# EAGLE design Bipolar_Stepper_Motor_Controller_RevA (EAGLE 6.5.0)
Unipolar (6 wire) stepper motor driver

## Sheet 1 of 5: PIC
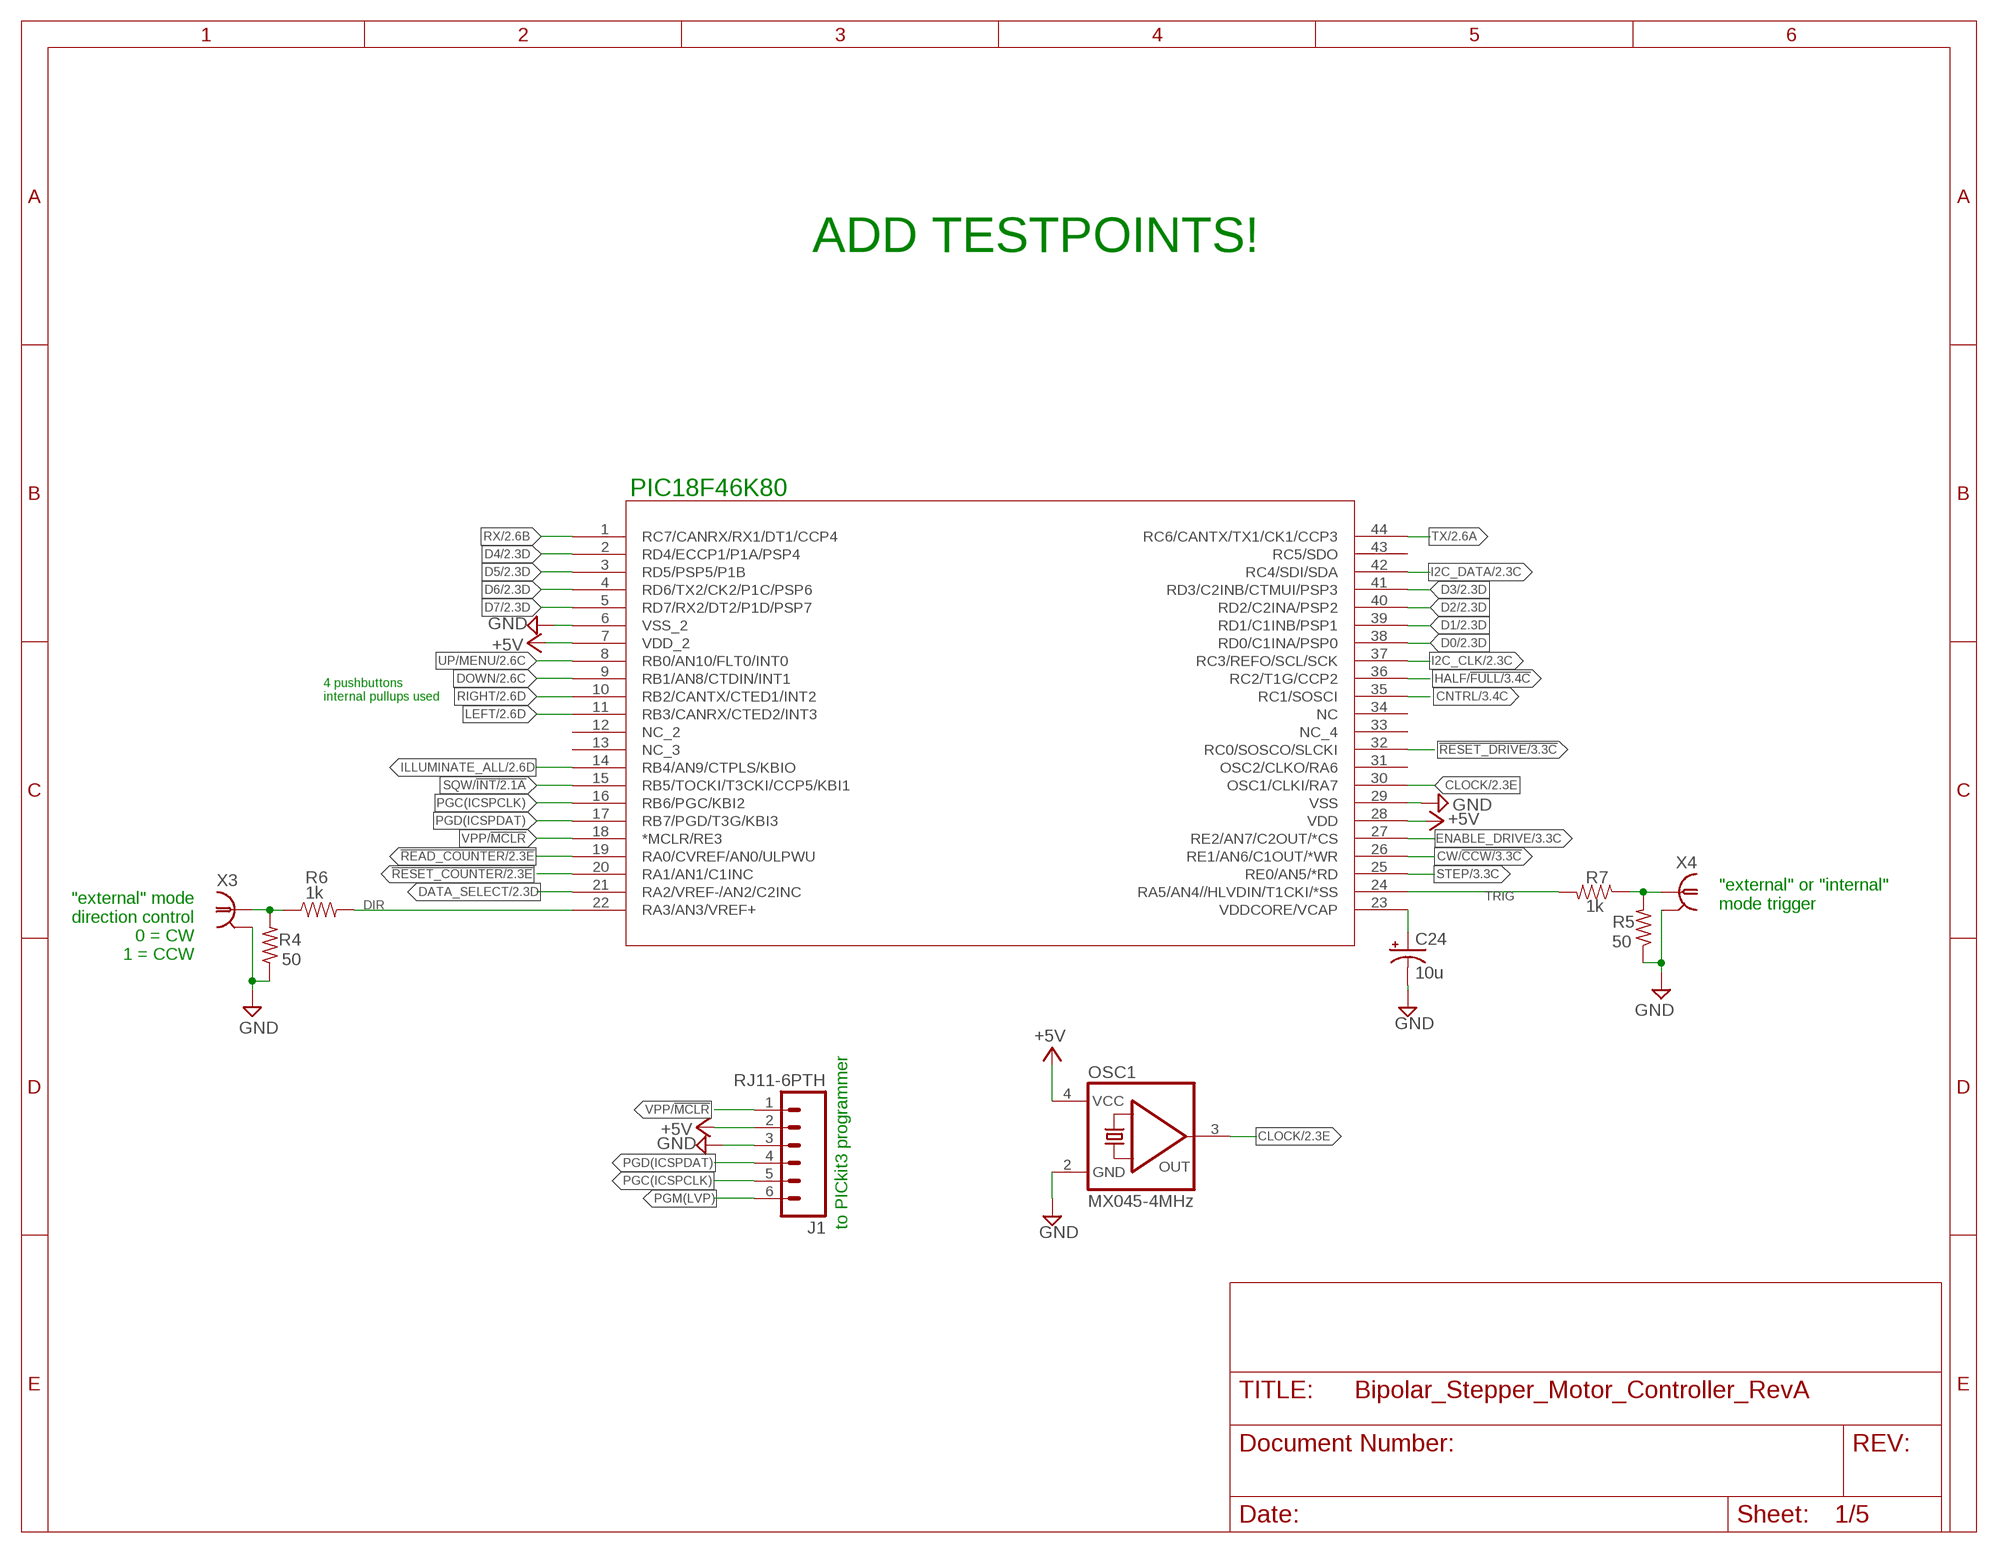
[diagram p0: schematic, sheet 1]

### Parts
C24  10u  CAP_POL1206  [EIA3216]
IC12  PIC18F46K80  [TQFP44_MC]
J1  RJ11-6PTH  [RJ11-6]
OSC1  MX045-4MHz  SG531  [DIL08-4]
R4  50  R-US_R2512  [R2512]
R5  50  R-US_R2512  [R2512]
R6  1k  RESISTOR  [0805]
R7  1k  RESISTOR  [0805]
X3  1-227161-0  [AMP_227161]
X4  1-227161-0  [AMP_227161]

### Nets
!READ_COUNTER: IC12.19(RA0/CVREF/AN0/ULPWU) ; also sheet 2
!RESET_COUNTER: IC12.20(RA1/AN1/C1INC) ; also sheet 2
!RESET_DRIVE: IC12.32(RC0/SOSCO/SLCKI) ; also sheet 3
+5V: IC12.7(VDD_2) IC12.28(VDD) J1.2 OSC1.4(VCC) ; also sheet 2,3,4,5
CLOCK: IC12.30(OSC1/CLKI/RA7) OSC1.3(OUT) ; also sheet 2
CNTRL: IC12.35(RC1/SOSCI) ; also sheet 3
CW/!CCW: IC12.26(RE1/AN6/C1OUT/*WR) ; also sheet 3
D0: IC12.38(RD0/C1INA/PSP0) ; also sheet 2
D1: IC12.39(RD1/C1INB/PSP1) ; also sheet 2
D2: IC12.40(RD2/C2INA/PSP2) ; also sheet 2
D3: IC12.41(RD3/C2INB/CTMUI/PSP3) ; also sheet 2
D4: IC12.2(RD4/ECCP1/P1A/PSP4) ; also sheet 2
D5: IC12.3(RD5/PSP5/P1B) ; also sheet 2
D6: IC12.4(RD6/TX2/CK2/P1C/PSP6) ; also sheet 2
D7: IC12.5(RD7/RX2/DT2/P1D/PSP7) ; also sheet 2
DATA_SELECT: IC12.21(RA2/VREF-/AN2/C2INC) ; also sheet 2
DIR: IC12.22(RA3/AN3/VREF+) R6.2
DOWN: IC12.9(RB1/AN8/CTDIN/INT1) ; also sheet 2
ENABLE_DRIVE: IC12.27(RE2/AN7/C2OUT/*CS) ; also sheet 3
GND: C24.C(-) IC12.6(VSS_2) IC12.29(VSS) J1.3 OSC1.2(GND) R4.1 R5.1 X3.2 X4.2 ; also sheet 2,3,4,5
HALF/!FULL: IC12.36(RC2/T1G/CCP2) ; also sheet 3
I2C_CLK: IC12.37(RC3/REFO/SCL/SCK) ; also sheet 2
I2C_DATA: IC12.42(RC4/SDI/SDA) ; also sheet 2
ILLUMINATE_ALL: IC12.14(RB4/AN9/CTPLS/KBIO) ; also sheet 2
LEFT: IC12.11(RB3/CANRX/CTED2/INT3) ; also sheet 2
N$2: R5.2 R7.1 X4.1
N$3: R4.2 R6.1 X3.1
N$47: C24.A(+) IC12.23(VDDCORE/VCAP)
PGC(ICSPCLK): IC12.16(RB6/PGC/KBI2) J1.5
PGD(ICSPDAT): IC12.17(RB7/PGD/T3G/KBI3) J1.4
PGM(LVP): J1.6
RIGHT: IC12.10(RB2/CANTX/CTED1/INT2) ; also sheet 2
RX: IC12.1(RC7/CANRX/RX1/DT1/CCP4) ; also sheet 2
SQW/!INT: IC12.15(RB5/TOCKI/T3CKI/CCP5/KBI1) ; also sheet 2
STEP: IC12.25(RE0/AN5/*RD) ; also sheet 3
TRIG: IC12.24(RA5/AN4//HLVDIN/T1CKI/*SS) R7.2
TX: IC12.44(RC6/CANTX/TX1/CK1/CCP3) ; also sheet 2
UP/MENU: IC12.8(RB0/AN10/FLT0/INT0) ; also sheet 2
VPP/!MCLR: IC12.18(*MCLR/RE3) J1.1
Unconnected: IC12.12(NC_2) IC12.13(NC_3) IC12.31(OSC2/CLKO/RA6) IC12.33(NC_4) IC12.34(NC) IC12.43(RC5/SDO)

### Notes on the sheet
- ADD TESTPOINTS!
- PIC18F46K80
- 4 pushbuttons
  internal pullups used
- "external" or "internal"
  mode trigger
- "external" mode
  direction control
  0 = CW
  1 = CCW
- to PICkit3 programmer

## Sheet 2 of 5: Peripheral Devices
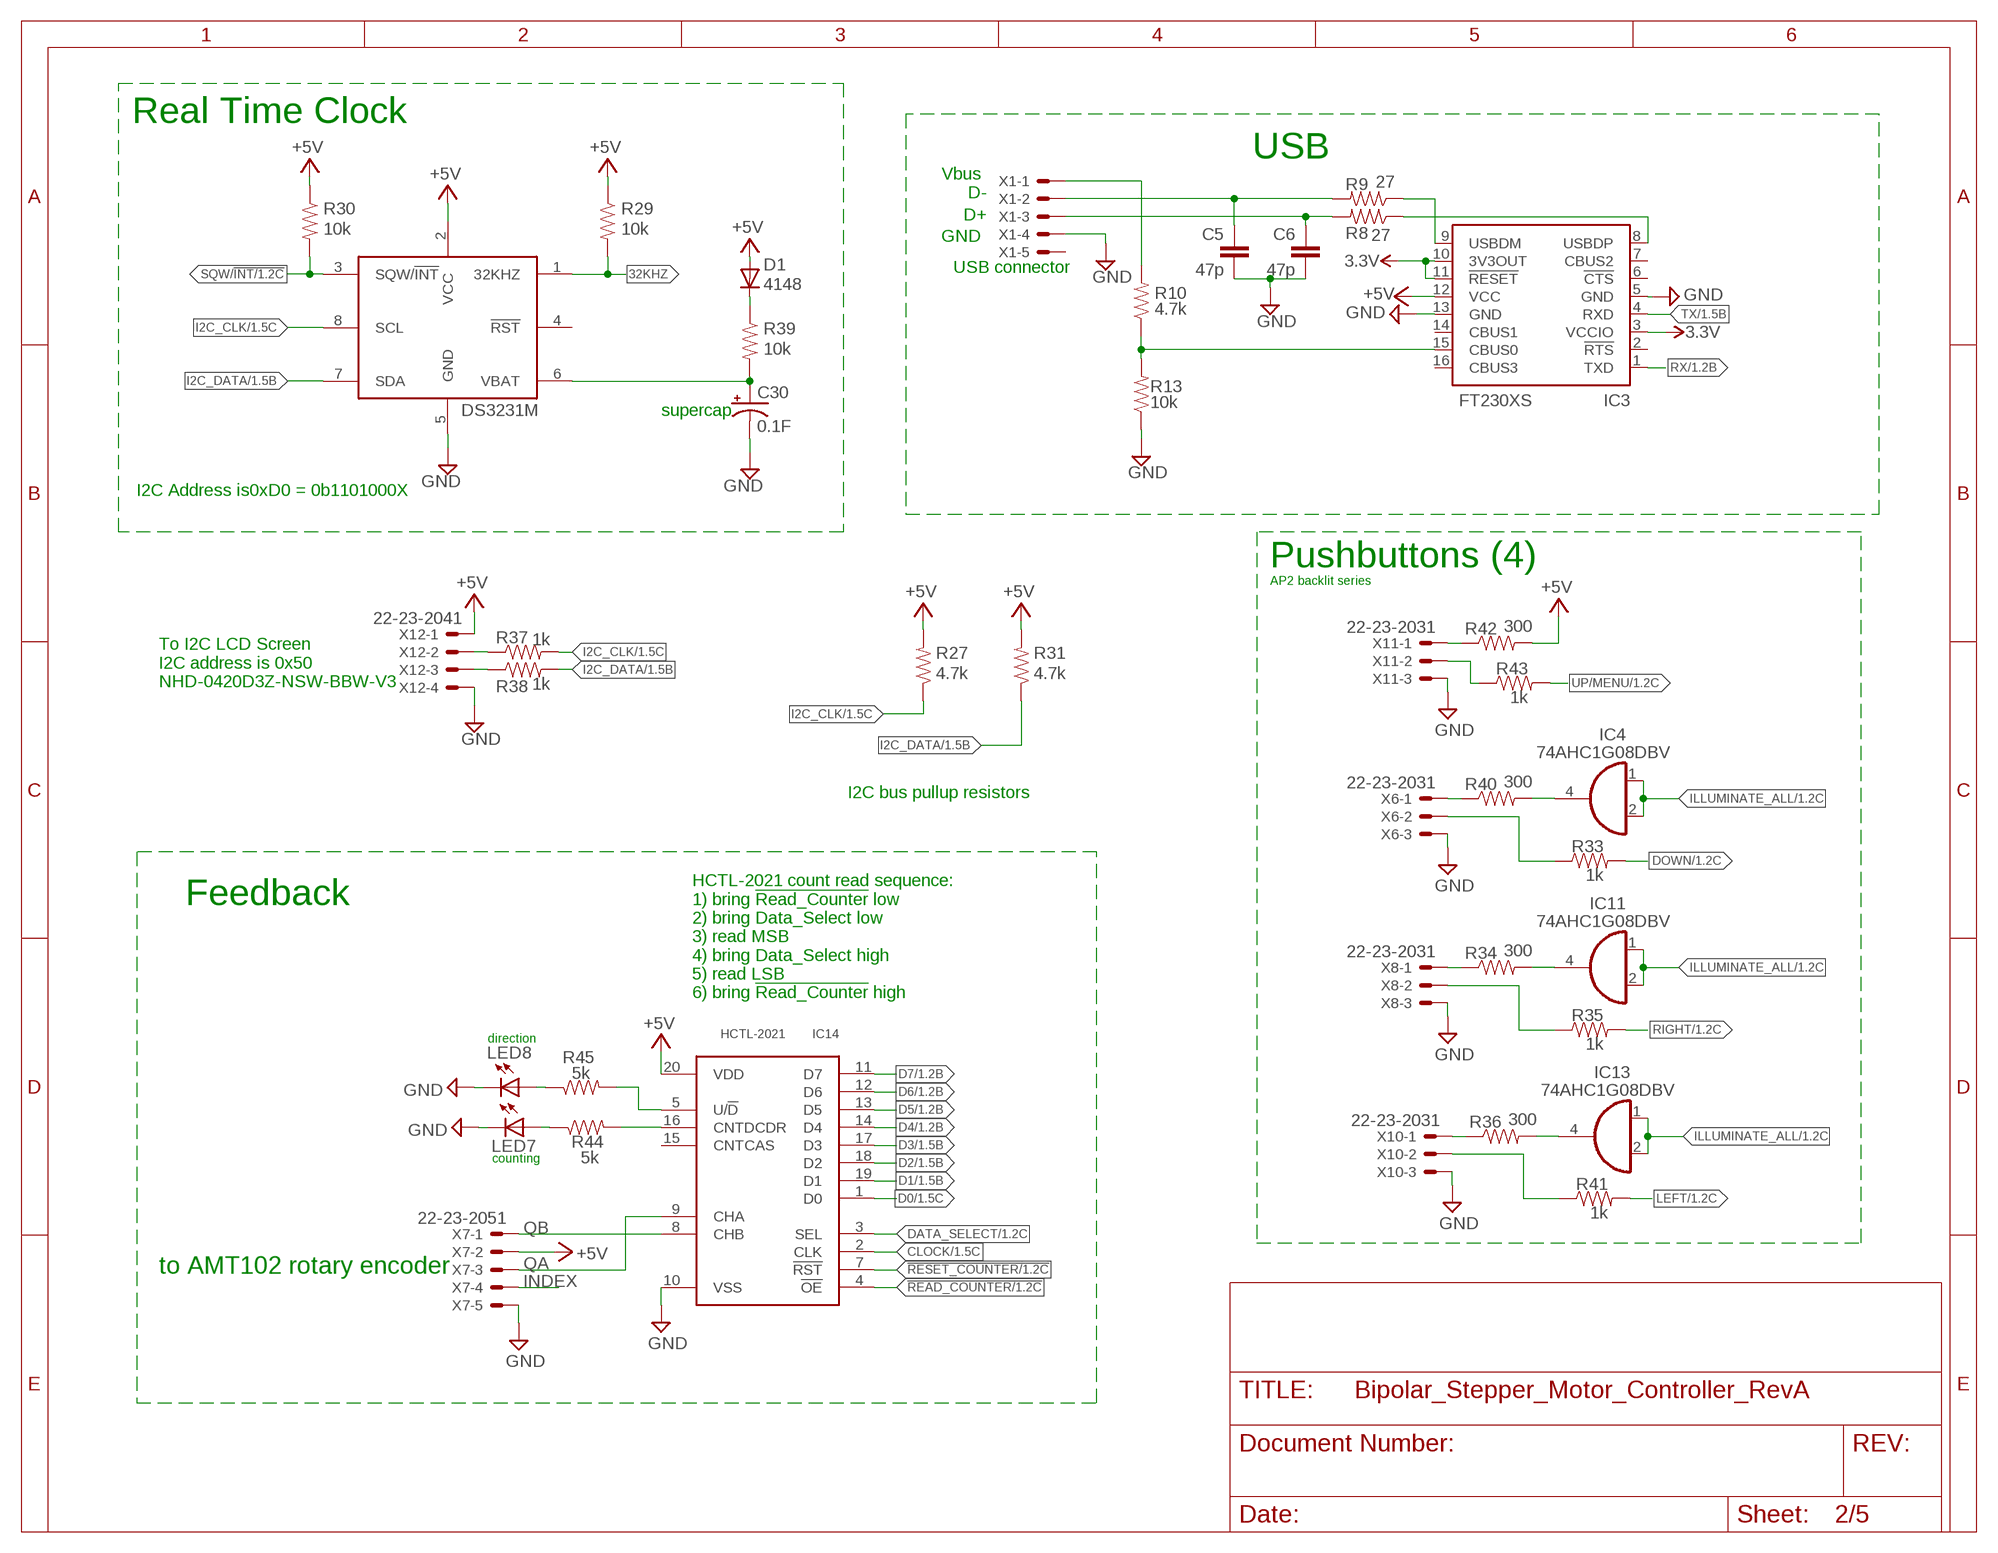
[diagram p1: schematic, sheet 2]

### Parts
C5  47p  CAP0805  [0805]
C6  47p  CAP0805  [0805]
C30  0.1F  CPOL-USP128-60  [P128-60]
D1  4148  DIODESOT23  [SOT23-3]
IC3  FT230XS  [SSOP16]
IC4  74AHC1G08DBV  [SOT23-5]
IC6  DS3231M  [8-SOIC]
IC11  74AHC1G08DBV  [SOT23-5]
IC13  74AHC1G08DBV  [SOT23-5]
IC14  HCTL-2021  [PLCC20]
LED7  red  LEDCHIPLED_0603  [CHIPLED_0603]
LED8  red  LEDCHIPLED_0603  [CHIPLED_0603]
R8  27  RESISTOR  [0805]
R9  27  RESISTOR  [0805]
R10  4.7k  RESISTOR  [0805]
R13  10k  RESISTOR  [0805]
R27  4.7k  RESISTOR0603-RES  [0603-RES]
R29  10k  RESISTOR0603-RES  [0603-RES]
R30  10k  RESISTOR0603-RES  [0603-RES]
R31  4.7k  RESISTOR0603-RES  [0603-RES]
R33  1k  RESISTOR  [0805]
R34  300  RESISTOR  [0805]
R35  1k  RESISTOR  [0805]
R36  300  RESISTOR  [0805]
R37  1k  RESISTOR  [0805]
R38  1k  RESISTOR  [0805]
R39  10k  RESISTOR0603-RES  [0603-RES]
R40  300  RESISTOR  [0805]
R41  1k  RESISTOR  [0805]
R42  300  RESISTOR  [0805]
R43  1k  RESISTOR  [0805]
R44  5k  RESISTOR0603-RES  [0603-RES]
R45  5k  RESISTOR0603-RES  [0603-RES]
X1  22-23-2051  [22-23-2051]
X6  22-23-2031  [22-23-2031]
X7  22-23-2051  [22-23-2051]
X8  22-23-2031  [22-23-2031]
X10  22-23-2031  [22-23-2031]
X11  22-23-2031  [22-23-2031]
X12  22-23-2041  [22-23-2041]

### Nets
3.3V: IC3.3(VCCIO) IC3.10(3V3OUT) IC3.11(!RESET) ; also sheet 5
32KHZ: IC6.1(32KHZ) R29.2
!READ_COUNTER: IC14.4(!OE) ; also sheet 1
!RESET_COUNTER: IC14.7(!RST) ; also sheet 1
+5V: D1.1(A) IC3.12(VCC) IC6.2(VCC) IC14.20(VDD) R27.2 R29.1 R30.1 R31.2 R42.2 X7.2 X12.1 ; also sheet 1,3,4,5
CLOCK: IC14.2(CLK) ; also sheet 1
D0: IC14.1(D0) ; also sheet 1
D1: IC14.19(D1) ; also sheet 1
D2: IC14.18(D2) ; also sheet 1
D3: IC14.17(D3) ; also sheet 1
D4: IC14.14(D4) ; also sheet 1
D5: IC14.13(D5) ; also sheet 1
D6: IC14.12(D6) ; also sheet 1
D7: IC14.11(D7) ; also sheet 1
D+: C6.1 R8.2 X1.3
D-: C5.1 R9.2 X1.2
DATA_SELECT: IC14.3(SEL) ; also sheet 1
DOWN: R33.2 ; also sheet 1
GND: C5.2 C6.2 C30.- IC3.5(GND) IC3.13(GND) IC6.5(GND) IC14.10(VSS) LED7.C LED8.C R13.1 X1.4 X6.3 X7.5 X8.3 X10.3 X11.3 X12.4 ; also sheet 1,3,4,5
I2C_CLK: IC6.8(SCL) R27.1 R37.2 ; also sheet 1
I2C_DATA: IC6.7(SDA) R31.1 R38.2 ; also sheet 1
ILLUMINATE_ALL: IC4.1(I0) IC4.2(I1) IC11.1(I0) IC11.2(I1) IC13.1(I0) IC13.2(I1) ; also sheet 1
INDEX: X7.4
LEFT: R41.2 ; also sheet 1
N$1: D1.3(C) R39.1
N$6: IC3.9(USBDM) R9.1
N$8: IC3.8(USBDP) R8.1
N$13: IC3.15(CBUS0) R10.1 R13.2
N$15: C30.+ IC6.6(VBAT) R39.2
N$17: R40.1 X6.1
N$18: IC4.4(O) R40.2
N$20: R33.1 X6.2
N$25: R34.1 X8.1
N$29: R37.1 X12.2
N$30: R38.1 X12.3
N$38: IC11.4(O) R34.2
N$39: R35.1 X8.2
N$40: R36.1 X10.1
N$41: IC13.4(O) R36.2
N$42: R41.1 X10.2
N$43: R42.1 X11.1
N$44: R43.1 X11.2
N$45: LED7.A R44.1
N$46: IC14.16(CNTDCDR) R44.2
N$48: LED8.A R45.1
N$49: IC14.5(U/!D) R45.2
QA: IC14.9(CHA) X7.3
QB: IC14.8(CHB) X7.1
RIGHT: R35.2 ; also sheet 1
RX: IC3.1(TXD) ; also sheet 1
SQW/!INT: IC6.3(SQW/!INT) R30.2 ; also sheet 1
TX: IC3.4(RXD) ; also sheet 1
UP/MENU: R43.2 ; also sheet 1
VBUS: R10.2 X1.1
Unconnected: IC3.2(!RTS) IC3.6(!CTS) IC3.7(CBUS2) IC3.14(CBUS1) IC3.16(CBUS3) IC6.4(!RST) IC14.15(CNTCAS) X1.5

### Notes on the sheet
- Real Time Clock
- USB
- Vbus
- D-
- D+
- GND
- USB connector
- supercap
- I2C Address is0xD0 = 0b1101000X
- Pushbuttons (4)
- AP2 backlit series
- To I2C LCD Screen
  I2C address is 0x50
  NHD-0420D3Z-NSW-BBW-V3
- I2C bus pullup resistors
- Feedback
- HCTL-2021 count read sequence:
  1) bring !Read_Counter! low
  2) bring Data_Select low 
  3) read MSB
  4) bring Data_Select high
  5) read LSB
  6) bring !Read_Counter! high
- direction
- counting
- to AMT102 rotary encoder

## Sheet 3 of 5: Motor Control
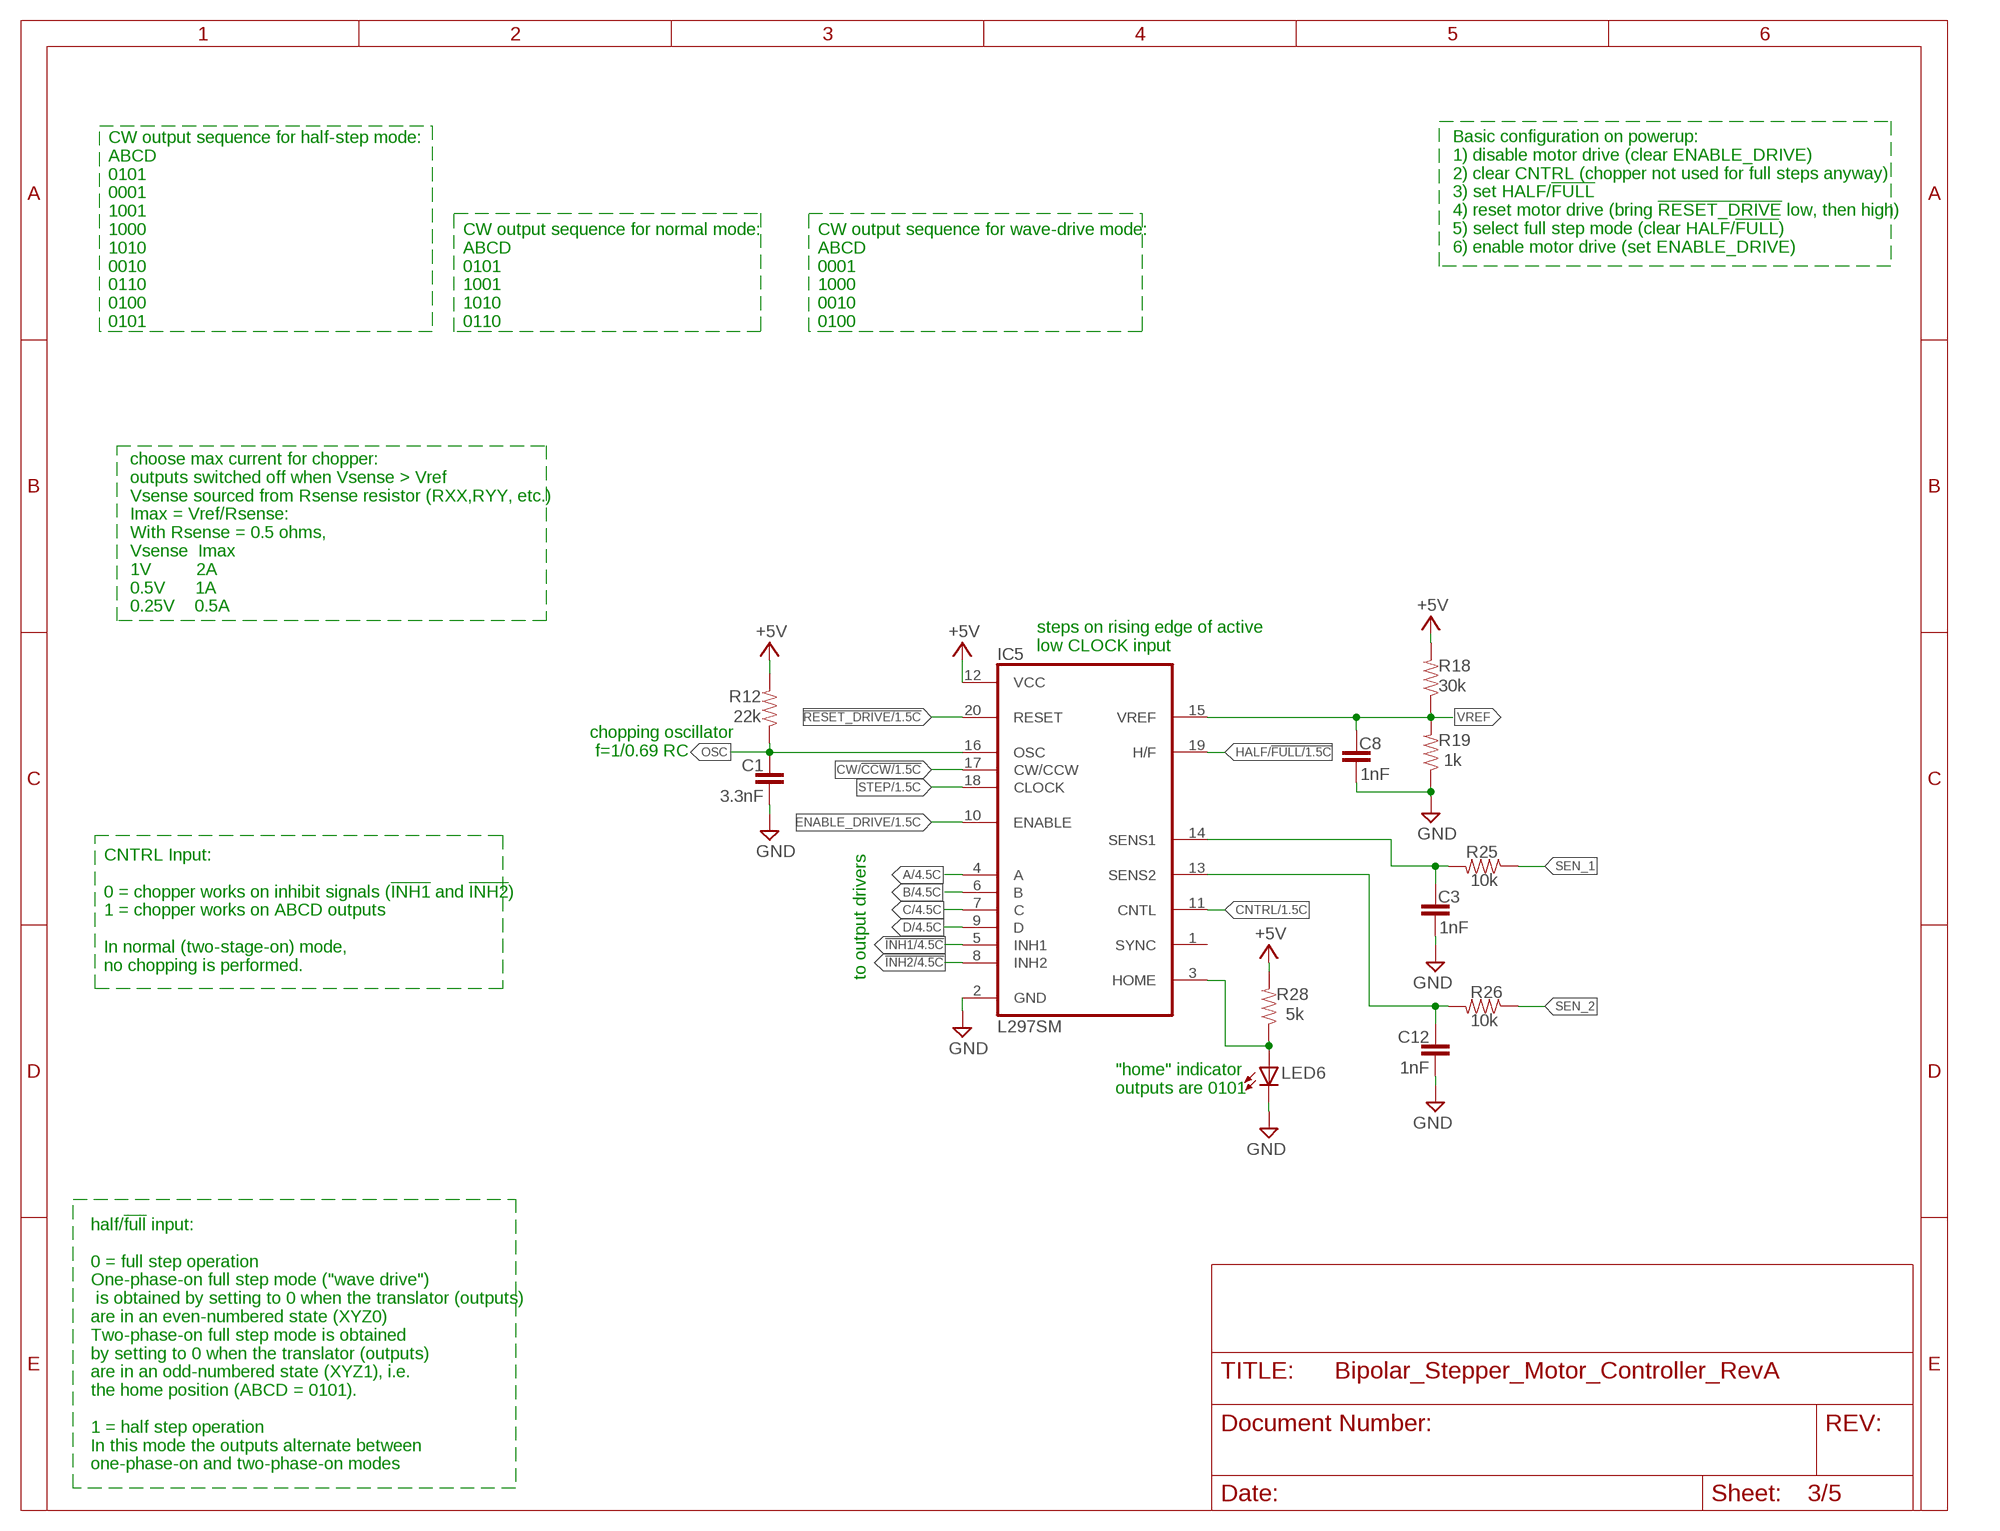
[diagram p2: schematic, sheet 3]

### Parts
C1  3.3nF  CAP0603-CAP  [0603-CAP]
C3  1nF  CAP0603-CAP  [0603-CAP]
C8  1nF  CAP0603-CAP  [0603-CAP]
C12  1nF  CAP0603-CAP  [0603-CAP]
IC5  L297SM  [SO20]
LED6  red  LEDCHIPLED_0603  [CHIPLED_0603]
R12  22k  RESISTOR0603-RES  [0603-RES]
R18  30k  RESISTOR0603-RES  [0603-RES]
R19  1k  RESISTOR0603-RES  [0603-RES]
R25  10k  RESISTOR0603-RES  [0603-RES]
R26  10k  RESISTOR0603-RES  [0603-RES]
R28  5k  RESISTOR0603-RES  [0603-RES]

### Nets
!INH1: IC5.5(INH1) ; also sheet 4
!INH2: IC5.8(INH2) ; also sheet 4
!RESET_DRIVE: IC5.20(RESET) ; also sheet 1
+5V: IC5.12(VCC) R12.2 R18.2 R28.2 ; also sheet 1,2,4,5
A: IC5.4(A) ; also sheet 4
B: IC5.6(B) ; also sheet 4
C: IC5.7(C) ; also sheet 4
CNTRL: IC5.11(CNTL) ; also sheet 1
CW/!CCW: IC5.17(CW/CCW) ; also sheet 1
D: IC5.9(D) ; also sheet 4
ENABLE_DRIVE: IC5.10(ENABLE) ; also sheet 1
GND: C1.2 C3.2 C8.2 C12.2 IC5.2(GND) LED6.C R19.1 ; also sheet 1,2,4,5
HALF/!FULL: IC5.19(H/F) ; also sheet 1
N$23: IC5.3(HOME) LED6.A R28.1
OSC: C1.1 IC5.16(OSC) R12.1
SEN_1: R25.1 ; also sheet 4
SEN_2: R26.1 ; also sheet 4
SENSE1: C3.1 IC5.14(SENS1) R25.2
SENSE2: C12.1 IC5.13(SENS2) R26.2
STEP: IC5.18(CLOCK) ; also sheet 1
VREF: C8.1 IC5.15(VREF) R18.1 R19.2
Unconnected: IC5.1(SYNC)

### Notes on the sheet
- Basic configuration on powerup:
  1) disable motor drive (clear ENABLE_DRIVE)
  2) clear CNTRL (chopper not used for full steps anyway)
  3) set HALF/!FULL!
  4) reset motor drive (bring !RESET_DRIVE! low, then high)
  5) select full step mode (clear HALF/!FULL!)
  6) enable motor drive (set ENABLE_DRIVE)
- CW output sequence for half-step mode:
  ABCD
  0101
  0001
  1001
  1000
  1010
  0010
  0110
  0100
  0101
- CW output sequence for normal mode:
  ABCD
  0101
  1001
  1010
  0110
- CW output sequence for wave-drive mode:
  ABCD
  0001
  1000
  0010
  0100
- choose max current for chopper:
  outputs switched off when Vsense > Vref
  Vsense sourced from Rsense resistor (RXX,RYY, etc.)
  Imax = Vref/Rsense:
  With Rsense = 0.5 ohms,
  Vsense  Imax
  1V         2A
  0.5V      1A
  0.25V    0.5A
- steps on rising edge of active
  low CLOCK input
- chopping oscillator
   f=1/0.69 RC
- CNTRL Input:
  
  0 = chopper works on inhibit signals (!INH1! and !INH2!)
  1 = chopper works on ABCD outputs
  
  In normal (two-stage-on) mode, 
  no chopping is performed.
- to output drivers
- "home" indicator
  outputs are 0101
- half/!full! input:
  
  0 = full step operation
  One-phase-on full step mode ("wave drive")
   is obtained by setting to 0 when the translator (outputs) 
  are in an even-numbered state (XYZ0)
  Two-phase-on full step mode is obtained 
  by setting to 0 when the translator (outputs) 
  are in an odd-numbered state (XYZ1), i.e. 
  the home position (ABCD = 0101).
  
  1 = half step operation
  In this mode the outputs alternate between 
  one-phase-on and two-phase-on modes

## Sheet 4 of 5: Output Drive
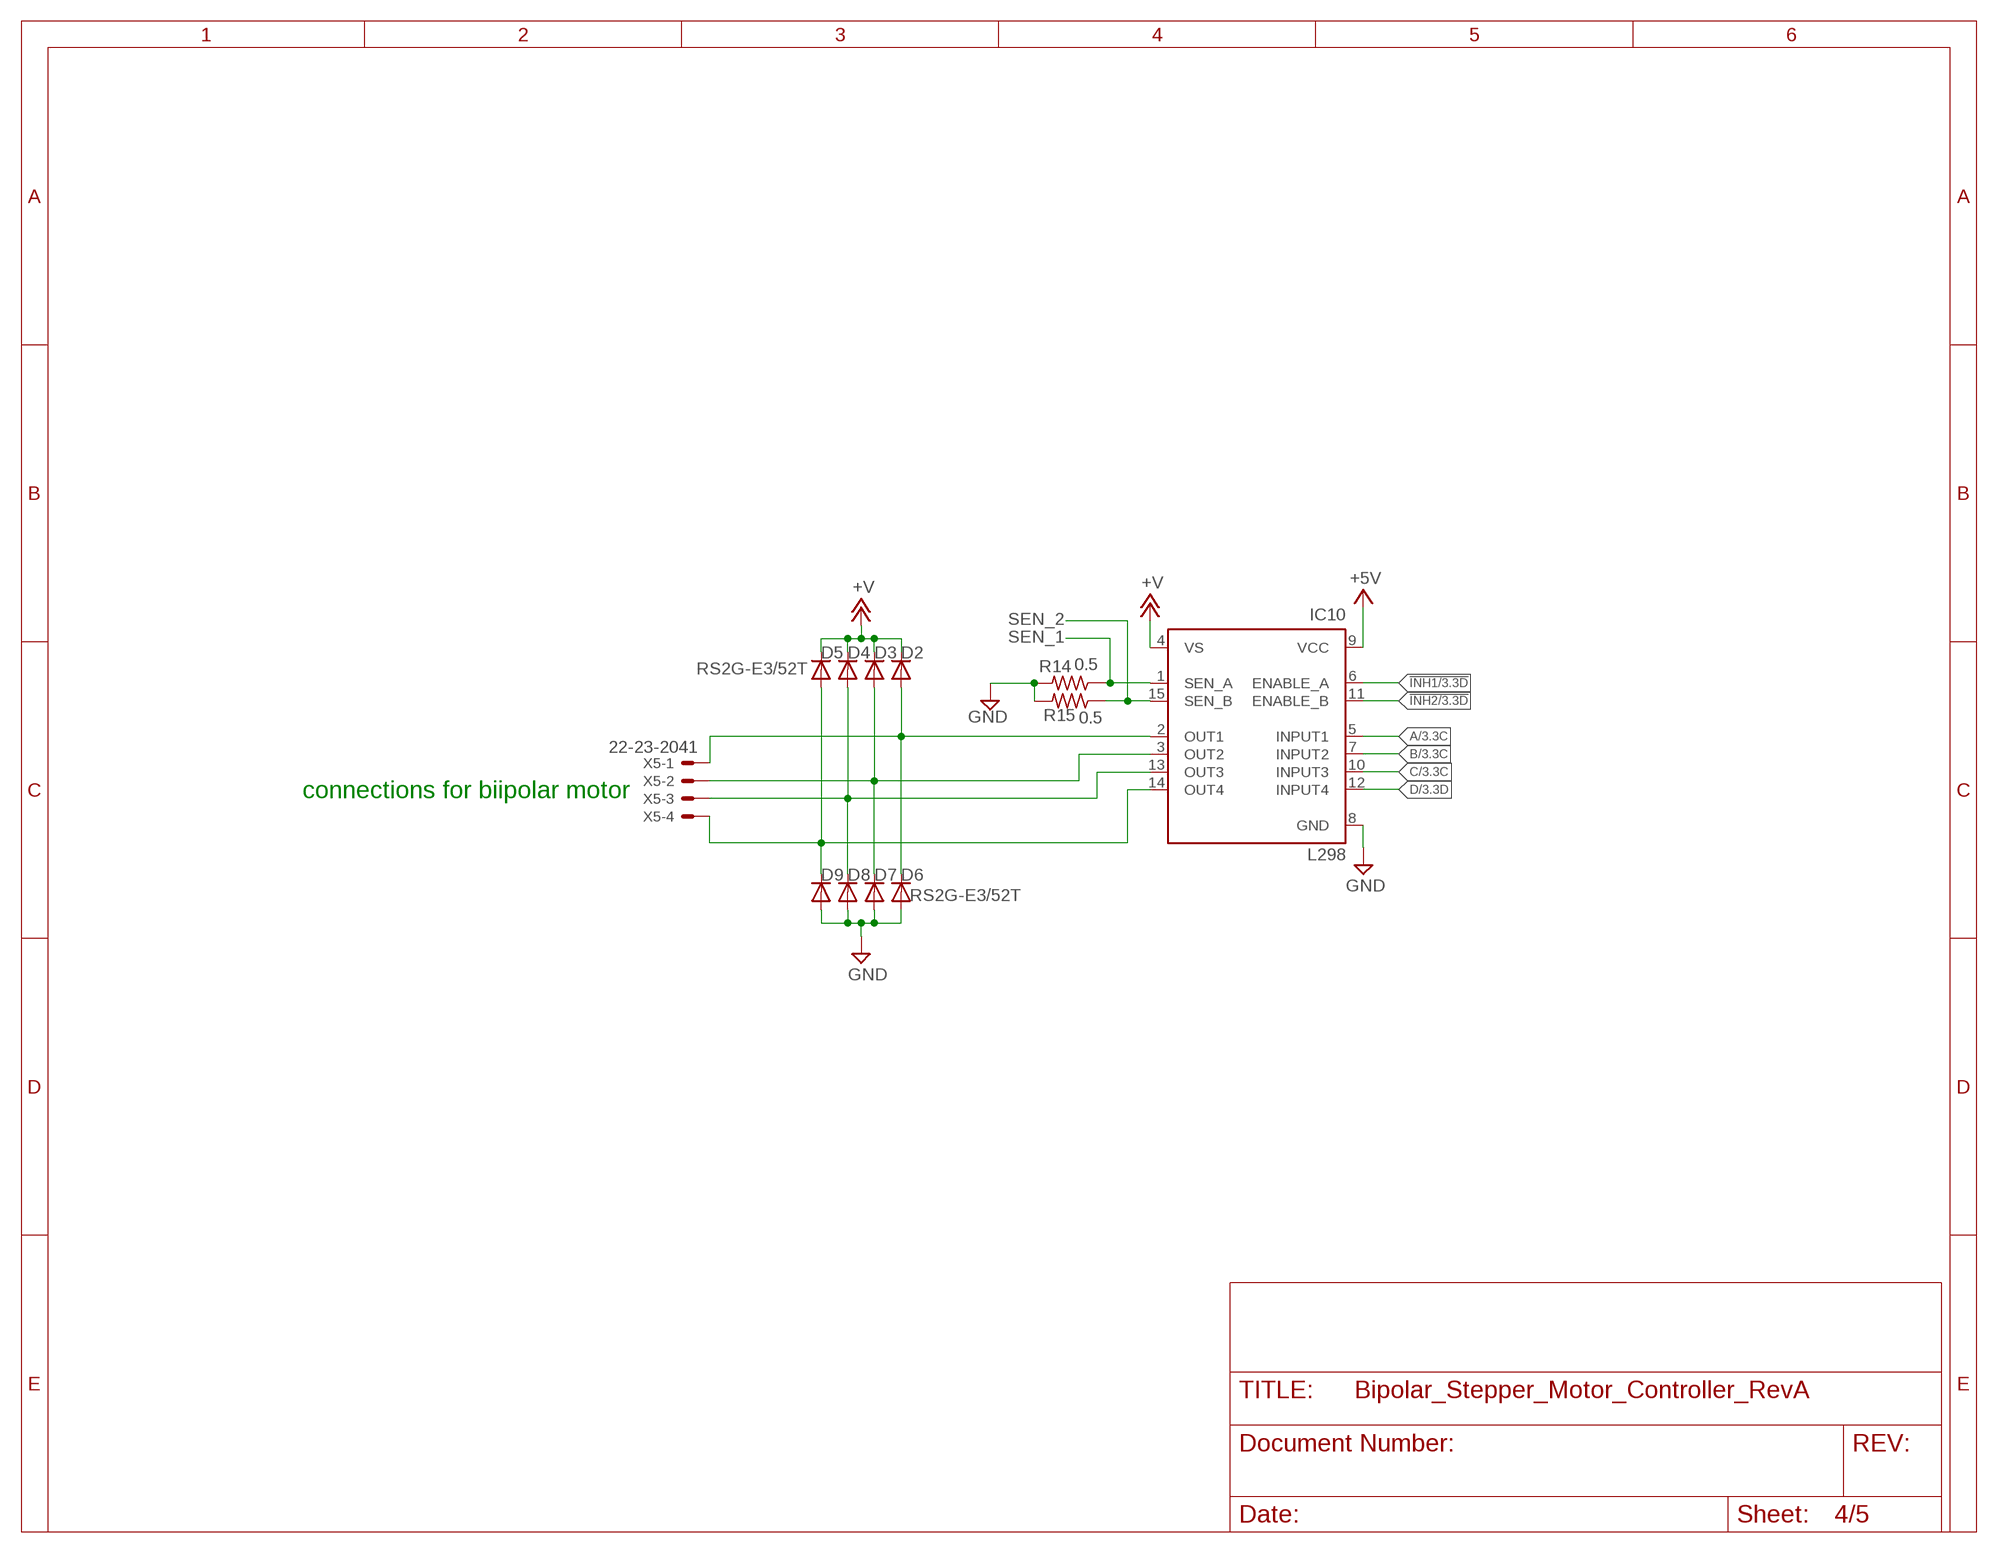
[diagram p3: schematic, sheet 4]

### Parts
D2  RS2G-E3/52T  DIODE-DO214AA  [DO214AA]
D3  RS2G-E3/52T  DIODE-DO214AA  [DO214AA]
D4  RS2G-E3/52T  DIODE-DO214AA  [DO214AA]
D5  RS2G-E3/52T  DIODE-DO214AA  [DO214AA]
D6  RS2G-E3/52T  DIODE-DO214AA  [DO214AA]
D7  RS2G-E3/52T  DIODE-DO214AA  [DO214AA]
D8  RS2G-E3/52T  DIODE-DO214AA  [DO214AA]
D9  RS2G-E3/52T  DIODE-DO214AA  [DO214AA]
IC10  L298  [MULTIWATT-15]
R14  0.5  R-US_R2512  [R2512]
R15  0.5  R-US_R2512  [R2512]
X5  22-23-2041  [22-23-2041]

### Nets
!INH1: IC10.6(ENABLE_A) ; also sheet 3
!INH2: IC10.11(ENABLE_B) ; also sheet 3
+5V: IC10.9(VCC) ; also sheet 1,2,3,5
+V: D2.C D3.C D4.C D5.C IC10.4(VS) ; also sheet 5
A: IC10.5(INPUT1) ; also sheet 3
B: IC10.7(INPUT2) ; also sheet 3
BI_A: D2.A D6.C IC10.2(OUT1) X5.1
BI_B: D3.A D7.C IC10.3(OUT2) X5.2
BI_C: D4.A D8.C IC10.13(OUT3) X5.3
BI_D: D5.A D9.C IC10.14(OUT4) X5.4
C: IC10.10(INPUT3) ; also sheet 3
D: IC10.12(INPUT4) ; also sheet 3
GND: D6.A D7.A D8.A D9.A IC10.8(GND) R14.2 R15.2 ; also sheet 1,2,3,5
SEN_1: IC10.1(SEN_A) R14.1 ; also sheet 3
SEN_2: IC10.15(SEN_B) R15.1 ; also sheet 3

### Notes on the sheet
- connections for biipolar motor

## Sheet 5 of 5: Power
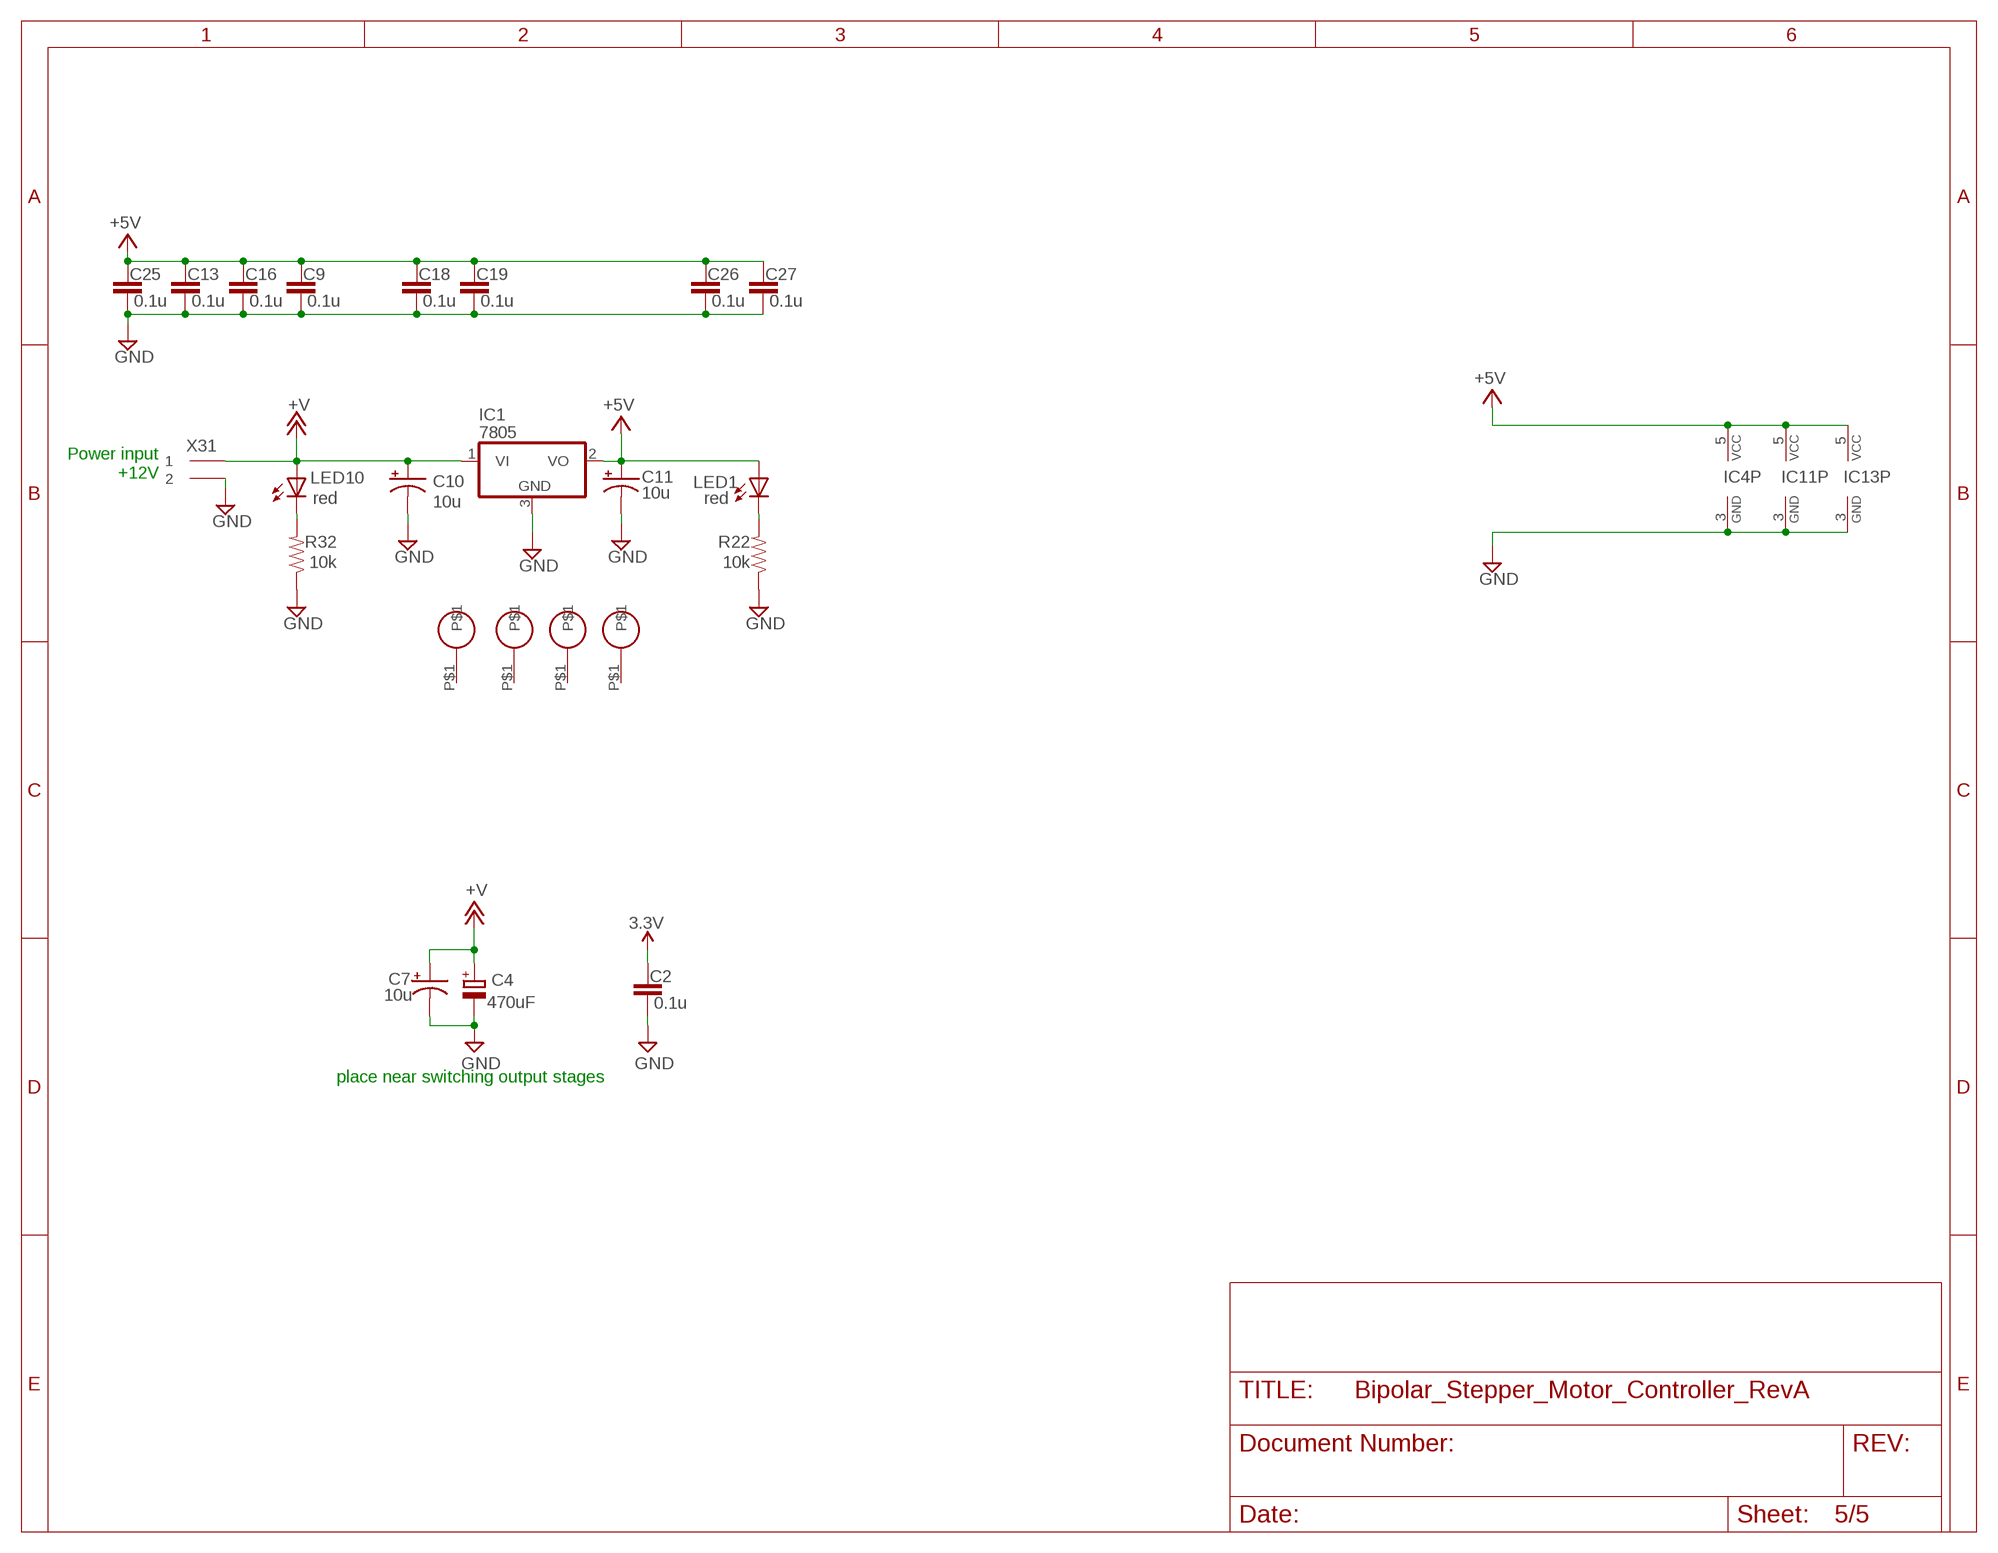
[diagram p4: schematic, sheet 5]

### Parts
C2  0.1u  CAP0603-CAP  [0603-CAP]
C4  470uF  CPOL-EUSANYO_SMD_F8  [SANYO-OSCON_SMD_F8]
C7  10u  CAP_POL1206  [EIA3216]
C9  0.1u  CAP0603-CAP  [0603-CAP]
C10  10u  CAP_POL1206  [EIA3216]
C11  10u  CAP_POL1206  [EIA3216]
C13  0.1u  CAP0603-CAP  [0603-CAP]
C16  0.1u  CAP0603-CAP  [0603-CAP]
C18  0.1u  CAP0603-CAP  [0603-CAP]
C19  0.1u  CAP0603-CAP  [0603-CAP]
C25  0.1u  CAP0603-CAP  [0603-CAP]
C26  0.1u  CAP0603-CAP  [0603-CAP]
C27  0.1u  CAP0603-CAP  [0603-CAP]
IC1  7805  7824DT  [TO252]
LED1  red  LEDCHIPLED_0805  [CHIPLED_0805]
LED10  red  LEDCHIPLED_0805  [CHIPLED_0805]
R22  10k  RESISTOR  [0805]
R32  10k  RESISTOR  [0805]
U$1  2-56  [2-56]
U$2  2-56  [2-56]
U$3  2-56  [2-56]
U$4  2-56  [2-56]
X31  SL_70543_2  [SL_70543_2]

### Nets
3.3V: C2.1 ; also sheet 2
+5V: C9.1 C11.A(+) C13.1 C16.1 C18.1 C19.1 C25.1 C26.1 C27.1 IC1.2(VO) IC4.5(VCC) IC11.5(VCC) IC13.5(VCC) LED1.A ; also sheet 1,2,3,4
+V: C4.+ C7.A(+) C10.A(+) IC1.1(VI) LED10.A X31.P$1 ; supply symbol labelled +12V ; also sheet 4
GND: C2.2 C4.- C7.C(-) C9.2 C10.C(-) C11.C(-) C13.2 C16.2 C18.2 C19.2 C25.2 C26.2 C27.2 IC1.3(GND) IC4.3(GND) IC11.3(GND) IC13.3(GND) R22.1 R32.1 X31.P$2 ; also sheet 1,2,3,4
LED1: LED1.C R22.2
LED5: LED10.C R32.2
Unconnected: U$1.P$1 U$2.P$1 U$3.P$1 U$4.P$1

### Notes on the sheet
- Power input
  +12V
- place near switching output stages

## Library data of the parts
C1-C3 C5 C6 C8 C9 C12 C13 C16 C18 C19 C25-C27 = SparkFun:CAP: Capacitor Standard 0603 ceramic capacitor, and 0.1" leaded capacitor.
C4 = rcl:CPOL-EU: POLARIZED CAPACITOR, European symbol
C7 C10 C11 C24 = SparkFun:CAP_POL: Capacitor Polarized These are standard SMD and PTH capacitors. Normally 10uF, 47uF, and 100uF in electrolytic and tantalum varieties. Always verify the external diameter of the through hole cap, it varies with capacity, voltage, and manufacturer. The EIA devices should be standard.
C30 = rcl:CPOL-US: POLARIZED CAPACITOR, American symbol
D1 = SparkFun:DIODE: Diode These are standard reverse protection diodes and small signal diodes. SMA package can handle up to about 1A. SOD-323 can handle about 200mA. What the SOD-323 package when ordering, there are some mfgs out there that are 5-pin packages.
D2-D9 = diode:DIODE-: DIODE
IC1 = linear:78*: Positive VOLTAGE REGULATOR Source: http://cache.national.com/ds/LM/LM78L05.pdf http://www.fairchildsemi.com/ds/LM/LM7805.pdf
IC3 = ftdichip:FT230X: USB to BASIC UART IC Auto generated by make-symbol-device-package-bsdl.ulp Rev. 43 Source: Data sheet <http://www.ftdichip.com/Support/Documents/DataSheets/ICs/DS_FT230X.pdf>
IC4 IC11 IC13 = 74xx-little-de:74*1G08: 2-input AND gate
IC5 = Fitch:L297: STEPPER MOTOR CONTROLLER
IC6 = Fitch_Eagle_Library:DS3231M: RTC (real time clock), I2C communication
IC10 = st-microelectronics:L298: DUAL FULL-BRIDGE DRIVER; MPN: L298N; OC_FARNELL: 1589425; OC_NEWARK: 32M1527
IC12 = PIC18F4620:PIC18F46K80
IC14 = Fitch:HCTL-2021: HCTL-2021 Quadrature decoder from Avago Technologies. 20 pin PLC package.
J1 = SparkFun:RJ11-6: RJ11 Jack Simple 6 pin RJ11 jack. Commonly found on CAT3 devices and Microchip programmers. SKU: PRT-00132
LED1 LED6-LED8 LED10 = led:LED: LED OSRAM: - CHIPLED LG R971, LG N971, LY N971, LG Q971, LY Q971, LO R971, LY R971 LH N974, LH R974 LS Q976, LO Q976, LY Q976 LO Q996 - Hyper CHIPLED LW Q18S LB Q993, LB Q99A, LB R99A - SideLED LS A670, LO A670, LY A670, LG A670, LP A670 LB A673, LV A673, LT A673, LW A673 LH A674 LY A675 LS A676, LA A676, LO A676, LY A676, LW A676 LS A679, LY A679, LG A679 - Hyper Micro SIDELED® LS Y876, LA Y876, LO Y876, LY Y876 LT Y87S - SmartLED LW L88C, LW L88S LB L89C, LB L89S, LG L890 LS L89K, LO L89K, LY L89K LS L896, LA L896, LO L896, LY L896 - TOPLED LS T670, LO T670, LY T670, LG T670, LP T670 LSG T670, LSP T670, LSY T670, LOP T670, LYG T670 LG T671, LOG T671, LSG T671 LB T673, LV T673, LT T673, LW T673 LH T674 LS T676, LA T676, LO T676, LY T676, LB T676, LH T676, LSB T676, LW T676 LB T67C, LV T67C, LT T67C, LS T67K, LO T67K, LY T67K, LW E67C LS E67B, LA E67B, LO E67B, LY E67B, LB E67C, LV E67C, LT E67C LW T67C LS T679, LY T679, LG T679 LS T770, LO T770, LY T770, LG T770, LP T770 LB T773, LV T773, LT T773, LW T773 LH T774 LS E675, LA E675, LY E675, LS T675 LS T776, LA T776, LO T776, LY T776, LB T776 LHGB T686 LT T68C, LB T68C - Hyper Mini TOPLED® LB M676 - Mini TOPLED Santana® LG M470 LS M47K, LO M47K, LY M47K Source: http://www.osram.convergy.de LUXEON: - LUMILED® LXK2-PW12-R00, LXK2-PW12-S00, LXK2-PW14-U00, LXK2-PW14-V00 LXK2-PM12-R00, LXK2-PM12-S00, LXK2-PM14-U00 LXK2-PE12-Q00, LXK2-PE12-R00, LXK2-PE12-S00, LXK2-PE14-T00, LXK2-PE14-U00 LXK2-PB12-K00, LXK2-PB12-L00, LXK2-PB12-M00, LXK2-PB14-N00, LXK2-PB14-P00, LXK2-PB14-Q00 LXK2-PR12-L00, LXK2-PR12-M00, LXK2-PR14-Q00, LXK2-PR14-R00 LXK2-PD12-Q00, LXK2-PD12-R00, LXK2-PD12-S00 LXK2-PH12-R00, LXK2-PH12-S00 LXK2-PL12-P00, LXK2-PL12-Q00, LXK2-PL12-R00 Source: www.luxeon.com KINGBRIGHT: KA-3528ASYC Source: www.kingbright.com
OSC1 = crystal:SG531: CRYSTAL RESONATOR
R4 R5 = rcl:R-US_: RESISTOR, American symbol
R6-R10 R12 R13 R18 R19 R22 R25-R45 = SparkFun:RESISTOR: Resistor Basic schematic elements and footprints for 0603, 1206, and PTH 1/10th watt (small) resistors.
R14 R15 = resistor:R-US_: RESISTOR, American symbol
U$1-U$4 = Fitch_Eagle_Library:2-56
X1 X7 = con-molex:22-23-2051: .100" (2.54mm) Center Header - 5 Pin; MF: MOLEX; MPN: 22-23-2051; OC_FARNELL: 1462952; OC_NEWARK: 38C9178
X3 X4 = con-coax:?227161*: JACK, RIGHT ANGLE, 50 OHM, PCB, BNC Source: amp_227161.pdf; MF: TYCO ELECTRONICS; MPN: 1-227161; OC_FARNELL: unknown; OC_NEWARK: 33B3200
X5 X12 = con-molex:22-23-2041: .100" (2.54mm) Center Header - 4 Pin; MF: MOLEX; MPN: 22-23-2041; OC_FARNELL: 1462920; OC_NEWARK: 38C0355
X6 X8 X10 X11 = con-molex:22-23-2031: .100" (2.54mm) Center Header - 3 Pin; MF: MOLEX; MPN: 22-23-2031; OC_FARNELL: 1462950; OC_NEWARK: 30C0862
X31 = Fitch_Eagle_Library:SL_70543_2

## Net classes
1 standard: width 0.61 mm, clearance 0.254 mm

## Board
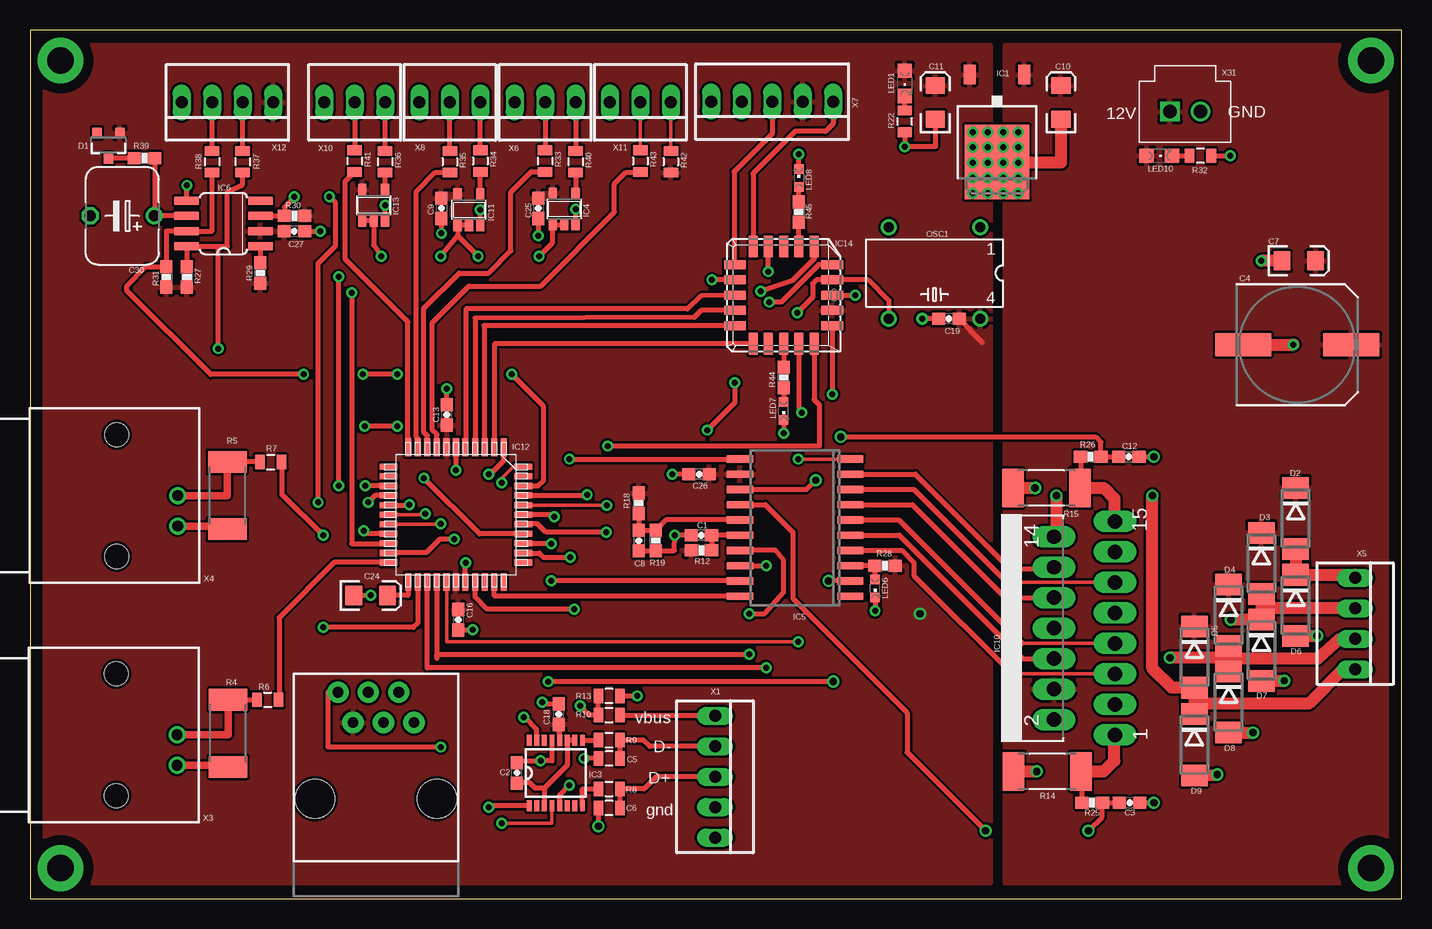
[diagram p5: board, top side]
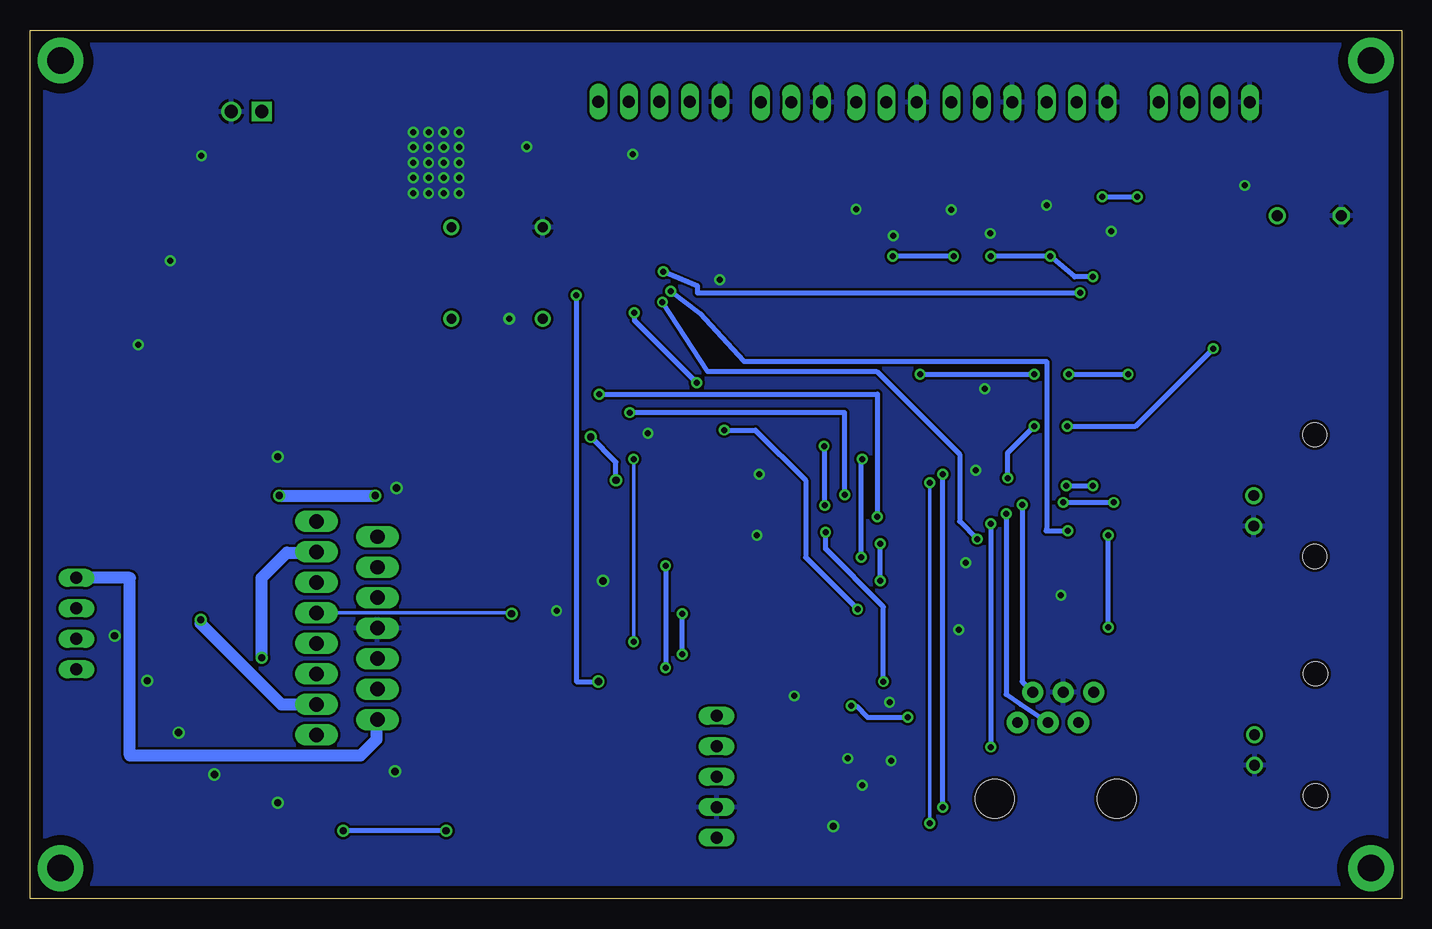
[diagram p6: board, bottom side, seen from below]

Size 114.3 x 72.39 mm. Coordinates in mm from the lower left corner, seen from the top.
Outline: 0,0 114.3,0 114.3,72.39 0,72.39 0,0
Copper layers (1*16): Top 0.035mm / dielectric 1.5mm / Bottom 0.035mm
Design rules "default *": minimum track width 10mil, minimum drill 19mil, track to track 8mil, track to pad 8mil, pad to pad 8mil, via to via 8mil, smd to smd 8mil, copper to edge 10mil, drill to drill 8mil, minimum pad ring 10mil, minimum via ring 8mil, stop-mask expansion 4mil, vias tented up to drill 0mil, thermal gap 10mil
tRestrict: area 2.5,69.8 to 2.5,69.8; area 2.5,2.5 to 2.5,2.5; area 111.8,2.5 to 111.8,2.5; area 111.8,69.8 to 111.8,69.8
bRestrict: area 2.5,69.8 to 2.5,69.8; area 2.6,2.5 to 2.6,2.5; area 111.8,2.5 to 111.8,2.5; area 111.8,69.8 to 111.8,69.8

### Footprints (pad centres in the part's own frame; a part is rotated, then mirrored left to right if it is on the bottom)
0603-CAP = smd 1.1 x 1: 1 -0.85,0; 2 0.85,0
SANYO-OSCON_SMD_F8 = smd 4.7 x 1.9: + 4.5,0; - -4.5,0
0805 = smd 0.8 x 1.2: 1 -0.9,0; 2 0.9,0
EIA3216 = smd 1.4 x 1.6: A 1.4,0; C -1.4,0
P128-60 = drill 0.914: + -2.667,0 | drill 0.914 octagon: - 2.667,0
SOT23-3 = smd 0.8 x 0.9: 1 -0.95,-1; 2 0.95,-1; 3 0,1.1
DO214AA = smd 1.8 x 2.2: A 2.55,0; C -2.55,0
TO252 = smd 1 x 1.6: 1 -2.28,-4.8; 2 2.28,-4.8 | smd 5.4 x 6.2: 3 0,2.5
SSOP16 = smd 0.914 x 0.406: 1 -2.718,2.223; 2 -2.718,1.587; 3 -2.718,0.953; 4 -2.718,0.318; 5 -2.718,-0.318; 6 -2.718,-0.953; 7 -2.718,-1.587; 8 -2.718,-2.223; 9 2.718,-2.223; 10 2.718,-1.587; 11 2.718,-0.953; 12 2.718,-0.318; 13 2.718,0.318; 14 2.718,0.953; 15 2.718,1.587; 16 2.718,2.223
SOT23-5 = smd 0.69 x 0.99: 1 -0.95,-1.29; 2 0,-1.29; 3 0.95,-1.29; 4 0.95,1.3; 5 -0.95,1.3
SO20 = smd 0.6 x 2.2: 1 -5.715,-4.6; 2 -4.445,-4.6; 3 -3.175,-4.6; 4 -1.905,-4.6; 5 -0.635,-4.6; 6 0.635,-4.6; 7 1.905,-4.6; 8 3.175,-4.6; 9 4.445,-4.6; 10 5.715,-4.6; 11 5.715,4.6; 12 4.445,4.6; 13 3.175,4.6; 14 1.905,4.6; 15 0.635,4.6; 16 -0.635,4.6; 17 -1.905,4.6; 18 -3.175,4.6; 19 -4.445,4.6; 20 -5.715,4.6
8-SOIC = smd 0.66 x 2.032: 1 -1.905,-3.073; 2 -0.635,-3.073; 3 0.635,-3.073; 4 1.905,-3.073; 5 1.905,3.073; 6 0.635,3.073; 7 -0.635,3.073; 8 -1.905,3.073
MULTIWATT-15 = drill 1.2 long: 1 -8.89,-7.62; 2 -7.62,-2.54; 3 -6.35,-7.62; 4 -5.08,-2.54; 5 -3.81,-7.62; 6 -2.54,-2.54; 7 -1.27,-7.62; 8 0,-2.54; 9 1.27,-7.62; 10 2.54,-2.54; 11 3.81,-7.62; 12 5.08,-2.54; 13 6.35,-7.62; 14 7.62,-2.54; 15 8.89,-7.62
TQFP44_MC = smd 1.473 x 0.508: 1 -5.613,3.988; 2 -5.613,3.2; 3 -5.613,2.388; 4 -5.613,1.6; 5 -5.613,0.787; 6 -5.613,0; 7 -5.613,-0.787; 8 -5.613,-1.6; 9 -5.613,-2.388; 10 -5.613,-3.2; 11 -5.613,-3.988; 23 5.613,-3.988; 24 5.613,-3.2; 25 5.613,-2.388; 26 5.613,-1.6; 27 5.613,-0.787; 28 5.613,0; 29 5.613,0.787; 30 5.613,1.6; 31 5.613,2.388; 32 5.613,3.2; 33 5.613,3.988 | smd 0.508 x 1.473: 12 -3.988,-5.613; 13 -3.2,-5.613; 14 -2.388,-5.613; 15 -1.6,-5.613; 16 -0.787,-5.613; 17 0,-5.613; 18 0.787,-5.613; 19 1.6,-5.613; 20 2.388,-5.613; 21 3.2,-5.613; 22 3.988,-5.613; 34 3.988,5.613; 35 3.2,5.613; 36 2.388,5.613; 37 1.6,5.613; 38 0.787,5.613; 39 0,5.613; 40 -0.787,5.613; 41 -1.6,5.613; 42 -2.388,5.613; 43 -3.2,5.613; 44 -3.988,5.613
PLCC20 = smd 1.8 x 0.76: 1 -4.05,0; 2 -4.05,-1.27; 3 -4.05,-2.54; 9 4.05,-2.54; 10 4.05,-1.27; 11 4.05,0; 12 4.05,1.27; 13 4.05,2.54; 19 -4.05,2.54; 20 -4.05,1.27 | smd 0.76 x 1.8: 4 -2.54,-4.05; 5 -1.27,-4.05; 6 0,-4.05; 7 1.27,-4.05; 8 2.54,-4.05; 14 2.54,4.05; 15 1.27,4.05; 16 0,4.05; 17 -1.27,4.05; 18 -2.54,4.05
RJ11-6 = drill 0.889 pad 1.778: 1 1.905,8.89; 2 3.175,6.35; 3 4.445,8.89; 4 5.715,6.35; 5 6.985,8.89; 6 8.255,6.35 | hole 3.251: 0,0; 10.16,0
CHIPLED_0805 = smd 1.2 x 1.2: A 0,-1.05; C 0,1.05
CHIPLED_0603 = smd 0.8 x 0.8: A 0,-0.75; C 0,0.75
DIL08-4 = drill 0.813: 1 -3.81,-3.81; 2 3.81,-3.81; 3 3.81,3.81; 4 -3.81,3.81
R2512 = smd 1.8 x 3.2: 1 -2.8,0; 2 2.8,0
0603-RES = smd 1.1 x 1: 1 -0.85,0; 2 0.85,0
2-56 = drill 2.2 pad 3.81: P$1 0,0
22-23-2051 = drill 1 long: 1 -5.08,0; 2 -2.54,0; 3 0,0; 4 2.54,0; 5 5.08,0
AMP_227161 = drill 0.9 pad 1.27: 1 0,-5.08; 2 -2.54,-5.08 | hole 2: -5.08,0; 5.08,0
22-23-2041 = drill 1 long: 1 -3.81,0; 2 -1.27,0; 3 1.27,0; 4 3.81,0
22-23-2031 = drill 1 long: 1 -2.54,0; 2 0,0; 3 2.54,0
SL_70543_2 = drill 1.1 square: P$1 0,0 | drill 1.1: P$2 2.54,0

### Placement (x,y rotation side)
C1  55.94,30.29 180 top
C2  40.58,10.48 90 top
C3  91.63,8 0 top
C4  105.6,46.16 0 top
C5  48.26,11.68 180 top
C6  48.26,7.56 180 top
C7  105.73,53.15 0 top
C8  50.74,29.84 270 top
C9  34.29,57.53 270 top
C10  85.92,66.36 90 top
C11  75.44,66.36 90 top
C12  91.57,36.83 0 top
C13  34.73,40.32 90 top
C16  35.69,23.24 270 top
C18  44.07,15.37 90 top
C19  76.58,48.32 180 top
C24  28.38,25.27 0 top
C25  42.35,57.53 270 top
C26  55.75,35.37 180 top
C27  22.03,55.63 0 top
C30  7.68,56.9 180 top
D1  6.54,62.8 180 top
D2  105.47,31.69 270 top
D3  102.62,27.94 270 top
D4  99.89,23.62 270 top
D5  97.03,20.13 270 top
D6  105.47,24.45 270 top
D7  102.62,20.7 270 top
D8  99.89,16.38 270 top
D9  97.03,12.83 270 top
IC1  80.58,63.88 180 top
IC3  43.81,10.48 90 top
IC4  44.51,57.47 0 top
IC5  63.75,30.92 90 top
IC6  16.13,56.26 90 top
IC10  82.8,22.54 90 top
IC11  36.58,57.4 0 top
IC12  35.5,32 270 top
IC13  28.64,57.78 0 top
IC14  62.8,50.29 180 top
J1  23.75,8.32 0 top
LED1  72.9,67.94 180 top
LED6  70.42,25.84 180 top
LED7  62.8,40.64 180 top
LED8  64.07,60.07 0 top
LED10  94.11,61.91 270 top
OSC1  75.37,52.13 180 top
R4  16.51,13.78 90 top
R5  16.45,33.59 90 top
R6  19.81,16.57 0 top
R7  20.07,36.39 0 top
R8  48.26,9.14 0 top
R9  48.26,13.21 0 top
R10  48.26,15.3 0 top
R12  55.94,29.02 180 top
R13  48.26,16.89 180 top
R14  84.77,10.6 180 top
R15  84.71,34.23 180 top
R18  50.74,32.96 90 top
R19  52.13,29.84 90 top
R22  72.9,64.77 90 top
R25  88.52,8 0 top
R26  88.39,36.83 0 top
R27  13.08,51.82 270 top
R28  71.25,27.75 0 top
R29  19.18,52.13 90 top
R30  22.03,56.9 180 top
R31  11.37,51.82 270 top
R32  97.54,61.91 180 top
R33  42.93,61.47 270 top
R34  37.53,61.47 270 top
R35  34.99,61.4 270 top
R36  29.59,61.4 270 top
R37  17.72,61.4 270 top
R38  15.18,61.4 270 top
R39  9.53,61.72 0 top
R40  45.47,61.4 270 top
R41  27.05,61.47 270 top
R42  53.4,61.4 270 top
R43  50.86,61.47 270 top
R44  62.8,43.43 90 top
R45  64.07,57.21 270 top
U$1  2.54,2.54 0 top
U$2  111.76,2.54 0 top
U$3  2.54,69.85 0 top
U$4  111.76,69.85 0 top
X1  57.09,10.16 270 top
X3  7.18,13.65 90 top
X4  7.24,33.59 90 top
X5  110.43,22.92 270 top
X6  42.93,66.36 180 top
X7  61.85,66.42 180 top
X8  34.99,66.36 180 top
X10  27.05,66.36 180 top
X11  50.86,66.36 180 top
X12  16.45,66.36 180 top
X31  95,65.6 0 top

### Tracks (layer width: path | path; a pad name or v marks a point on that pad's centre or on a via)
3.3V
  Top 0.406: IC3.10 IC3.11 | IC3.11 45.09,13.2 45.09,13.21 | IC3.11 44.77,11.11 42.86,9.21 | 42.86,9.21 IC3.3 | 42.86,9.21 42.1,9.21 41.66,9.65 40.6,9.65 C2.1
32KHZ
  Top 0.406: IC6.1 R29.2
!INH1
  Top 0.406: IC5.5 72.45,30.29 82.74,20 IC10.6
!INH2
  Top 0.305: 81.41,26.35 IC10.11
  Top 0.406: IC5.8 73.66,34.1 81.41,26.35
!READ_COUNTER  (via drill 0.5)
  Top 0.406: IC14.4 65.34,53.34 63.5,51.5 v60.9,50.61 | IC12.19 29.87,30.42 27.81,30.42 v27.81,30.67
  Bottom 0.406: v60.9,50.61 58.48,48.77 54.8,44.77 29.59,44.77 29.59,30.82 29.63,30.66 27.83,30.66 v27.81,30.67
!RESET_COUNTER  (via drill 0.5)
  Top 0.406: v26.8,50.48 26.8,29.59 29.86,29.59 IC12.20 | v61.53,52.26 IC14.7
  Bottom 0.406: v26.8,50.48 58.67,50.48 58.67,51.05 v61.53,52.26
!RESET_DRIVE
  Top 0.406: IC5.20 38.7,25.21 IC12.32
+5V  (via drill 0.6)
  Top 0.406: IC3.12 44.13,14.45 C18.1 | 79.34,46.36 C19.1
  Bottom 0.305: IC10.9 74.23,23.81
  Bottom 0.406: 74.23,23.81 v74.17,23.75
  pour Top (isolate 0.203): 1.27,71.12 80.01,71.12 80.01,1.27 1.27,1.27
+V
  Top 0.406: LED10.A 92.84,61.91
  pour Top (isolate 0.203): 81.28,71.12 113.03,71.12 113.03,1.27 81.28,1.27
A
  Top 0.305: 81.85,18.73 IC10.5
  Top 0.406: IC5.4 72.64,29.02 73.66,28 73.66,26.92 81.85,18.73
B
  Top 0.305: 82.68,21.27 IC10.7
  Top 0.406: IC5.6 72.39,31.56 82.68,21.27
BI_A
  Top 1.016: D2.A D6.C 110.43,27 X5.1
  Bottom 1.016: IC10.2 85.41,14.86 85.41,13.27 86.74,11.94 105.98,11.94 105.98,26.74 110.16,26.74 X5.1
BI_B  (via drill 0.6)
  Top 1.016: D3.A 102.62,24.19 | 102.62,24.19 D7.C 100.09,23.25 v100.08,23.24 | X5.2 102.62,24.19
  Bottom 1.016: v100.08,23.24 100.08,22.92 93.34,16.19 IC10.3
BI_C  (via drill 0.6)
  Top 1.016: 99.89,19.56 D4.A 99.89,20.13 99.95,20.07 v95,20.07 | 99.89,19.56 D8.C | X5.3 109.16,21.65 107.31,20 100.14,20 99.89,19.56
  Bottom 1.016: v95,20.07 95,26.73 92.9,28.83 90.49,28.83 IC10.13
BI_D  (via drill 0.6)
  Top 1.016: 97.03,16.38 D5.A 95.13,17.58 93.53,19.18 v93.53,33.59 | 97.03,16.38 D9.C | X5.4 109.41,19.11 106.55,16.26 97.16,16.26 97.03,16.38 | v85.53,33.59 85.53,30.35 IC10.14
  Bottom 1.016: v93.53,33.59 v85.53,33.59
C
  Top 0.406: IC5.7 73.53,32.83 81.28,25.08 IC10.10
CLOCK  (via drill 0.5)
  Top 0.406: v63.94,48.83 65.22,50.1 65.22,51.24 65.53,51.56 IC14.2 69.85,51.56 71.56,49.85 OSC1.3 | v58.74,42.99 58.74,41.34 v56.45,39.05 | v45.34,24.13 38.1,24.13 37.08,25.15 37.08,26.38 IC12.30
  Bottom 0.406: v63.94,48.83 63.94,48.2 v58.74,42.99 | v56.45,39.05 53.85,39.05 49.66,34.86 49.66,28.45 v45.34,24.13
CNTRL  (via drill 0.5)
  Top 0.406: IC12.35 42.44,28.8 42.8,28.45 v45.02,28.45 | v44.96,36.64 IC5.11
  Bottom 0.406: v45.02,28.45 45.02,36.58 v44.96,36.64
CW/!CCW  (via drill 0.5)
  Top 0.406: IC12.26 33.9,20.02 33.91,20.38 v59.94,20.38 | v59.94,23.75 61.21,23.75 62.8,25.53 62.8,28.19 62.17,29.02 IC5.17
  Bottom 0.406: v59.94,20.38 v59.94,23.75
D
  Top 0.406: IC5.9 73.79,35.37 81.66,27.5 85.22,27.5 IC10.12
D0  (via drill 0.5, 0.6)
  Top 0.406: IC14.1 v68.77,50.29 | v48.01,30.54 42.99,30.54 42.29,31.24 41.13,31.24 IC12.38 | v66.93,18.1 v43.18,18.1
  Bottom 0.406: v68.77,50.29 68.77,18.1 v66.93,18.1 | v43.18,18.1 43.18,24.32 48.01,29.15 v48.01,30.54
D1  (via drill 0.5)
  Top 0.406: IC14.19 66.85,42.05 v66.86,42.04 | v43.69,31.81 43.69,32 IC12.39
  Bottom 0.406: v66.86,42.04 43.69,42.04 v43.69,31.81
D2  (via drill 0.5)
  Top 0.305: v48.07,32.77 41.13,32.77
  Top 0.406: IC14.18 65.34,41.59 65.79,41.15 65.79,37.72 v48.13,37.72 | 41.13,32.77 IC12.40
  Bottom 0.406: v48.13,37.72 48.13,32.83 v48.07,32.77
D3  (via drill 0.5)
  Top 0.406: IC14.17 64.07,40.51 v64.33,40.51 | IC12.41 46.29,33.6 v46.42,33.66
  Bottom 0.406: 46.42,33.59 v46.42,33.66 46.42,40.51 v64.33,40.51
D4
  Top 0.406: IC14.14 38.7,46.24 IC12.2
D5
  Top 0.406: IC14.13 37.85,47.75 37.85,37.66 IC12.3
D6
  Top 0.406: IC14.12 55.94,49.02 55.37,48.45 37.08,48.39 37.08,37.63 IC12.4
D7
  Top 0.406: IC14.11 55.94,50.23 54.8,49.15 36.32,49.15 36.32,37.66 IC12.5
D+
  Top 0.406: C6.1 R8.2 51.18,9.14 52.2,10.16 X1.3
D-
  Top 0.406: C5.1 R9.2 51.12,13.21 51.63,12.7 X1.2
DATA_SELECT  (via drill 0.5)
  Top 0.406: IC14.3 65.72,52.83 62.61,49.72 v61.59,49.72 | v35.37,29.97 34.16,29.97 33.02,28.83 29.91,28.83 IC12.21
  Bottom 0.406: v61.59,49.72 57.85,43.94 43.75,43.94 36.83,37.02 36.83,31.43 v35.37,29.97
DIR
  Top 0.406: IC12.22 25.35,28.02 20.77,23.43 20.77,16.63 R6.2
DOWN
  Top 0.406: IC12.9 33.11,38.58 32.83,38.86 32.83,49.21 35.75,52.13 38.23,52.13 40.07,53.98 40.07,58.86 41.78,60.58 42.91,60.58 R33.2
ENABLE_DRIVE  (via drill 0.5)
  Top 0.305: IC5.10 v64.01,36.64 | v64.01,21.4 34.71,21.4 IC12.27
  Bottom 0.305: v64.01,36.64 v64.01,21.4
GND  (via drill 0.5, 0.5 pad 1.02, 0.6)
  Top 0.406: C5.2 v46.16,11.68 | R22.1 v72.9,62.67 75.44,62.67 C11.C | R32.1 v100.01,61.91 | IC3.13 43.5,11.49 v42.55,11.49 40.7,11.49 40.58,11.37 C2.2 | R13.1 v50.61,16.89 | IC14.10 v56.83,51.56 | C13.2 v34.73,42.48 | IC12.6 v35.5,35.69 | IC12.29 36.28,27.9 v36.32,28 | C16.2 v36.89,22.42 | IC3.5 44.13,8.64 v44.96,9.46 | C19.2 v74.36,48.32 | C1.2 v53.72,30.29 53.7,29 R19.1 C8.2 | C27.2 v24.19,55.63 | C26.2 v53.53,35.37 | IC6.5 13.06,59.41 v13.08,59.44 | LED8.C v64.07,62.04 | LED6.C v70.42,24 | LED7.C v62.8,38.8 | C25.2 v42.35,55.24 | IC4.3 v45.46,57.47 v45.47,57.47 | C9.2 v34.29,55.44 | IC11.3 v37.53,57.4 | IC13.3 29.59,57.85 v29.59,57.78 | C24.C v28.38,25.27 | C18.2 42.84,16.22 v42.67,16.38 | C12.2 v93.66,36.83 | C3.2 v93.66,8 | IC5.2 v66.55,26.48 | C6.2 47.36,6.04 v47.37,6.03
  Top 0.61: R5.1 16.45,31.05 X4.2 | R4.1 16.51,11.11 X3.2
  Top 1.016: C10.C 85.92,61.34 v82.36,61.34 v81.09,61.34 80.58,61.34 IC1.3 | C7.C v102.62,53.15 | C4.- v105.28,46.16 | D6.A 107.24,21.9 v107.25,21.91 | D7.A v104.51,18.15 v104.52,18.16 | D8.A 101.91,13.83 v101.92,13.84 | D9.A v98.92,10.34 v98.93,10.35 | R15.2 v83.76,34.23 | R14.2 v83.88,10.6
  other vias: 78.55,63.88 79.82,63.88 81.09,63.88 82.36,63.88 78.55,62.61 79.82,62.61 81.09,62.61 82.36,62.61 79.82,61.34 78.55,61.34 78.55,60.07 79.82,60.07 81.09,60.07 82.36,60.07 78.55,58.8 79.82,58.8 81.09,58.8 82.36,58.8
  pour Bottom (isolate 0.203): 1.27,71.12 113.03,71.12 113.03,1.27 1.27,1.27
HALF/!FULL  (via drill 0.5)
  Top 0.406: IC5.19 v43.43,26.48 | v43.43,29.59 41.11,29.59 IC12.36
  Bottom 0.406: v43.43,26.48 v43.43,29.59
I2C_CLK  (via drill 0.5)
  Top 0.406: R27.1 13.06,52.69 IC6.8 15.68,54.36 | 15.68,54.36 16.45,54.36 16.45,58.93 17.72,59.5 R37.2 | IC12.37 37.48,30.4 v32.83,35.05 | v30.61,39.37 v27.88,39.37 | v15.68,45.85 15.68,54.36
  Bottom 0.406: v32.83,35.05 32.83,37.15 v30.61,39.37 | v27.88,39.37 22.16,39.37 v15.68,45.85
I2C_DATA  (via drill 0.5)
  Top 0.406: R38.2 15.18,55.63 IC6.7 11.37,55.63 R31.1 11.34,52.64 9.65,52.64 8.06,51.05 8.06,50.67 15.05,43.69 v22.8,43.69 | IC12.42 42.33,34.39 42.8,34.86 42.8,41.02 v40.13,43.69 | v30.61,43.69 v27.75,43.69
  Bottom 0.406: v40.13,43.69 v30.61,43.69 | v27.75,43.69 v22.8,43.69
ILLUMINATE_ALL  (via drill 0.5)
  Top 0.406: IC4.2 IC4.1 43.56,54.67 v42.42,53.53 | IC11.2 IC11.1 35.63,55.24 | 35.63,55.24 v37.34,53.53 | IC13.1 IC13.2 28.64,54.48 v29.27,53.53 | v34.23,53.53 35.63,55.24 | IC12.14 27.96,34.39 v27.94,34.42 | v25.72,34.42 v25.72,51.82
  Bottom 0.406: v37.34,53.53 v42.42,53.53 | v34.23,53.53 v29.27,53.53 27.24,51.82 v25.72,51.82 | v27.94,34.42 v25.72,34.42
LED1
  Top 0.406: R22.2 LED1.C
LED5
  Top 0.406: LED10.C R32.2
LEFT
  Top 0.406: IC12.11 31.51,38.41 31.5,38.42 31.5,48.07 26.29,53.28 26.29,59.81 R41.2
N$1
  Top 0.406: R39.1 6.56,61.72
  Top 0.61: 6.56,61.72 D1.3
N$2
  Top 0.406: R7.1 R5.2
  Top 0.61: R5.2 16.45,33.59 X4.1
N$3
  Top 0.406: R4.2 R6.1
  Top 0.61: R4.2 16.51,13.65 X3.1
N$6
  Top 0.406: IC3.9 R9.1
N$8
  Top 0.406: IC3.8 46.04,9.14 R8.1
N$13  (via drill 0.5)
  Top 0.406: R13.2 R10.1 46.61,15.3 v45.85,16.07 | IC3.15 42.23,14.1 41.21,15.11 v41.15,15.11
  Bottom 0.406: v45.85,16.07 45.47,16.07 44.51,15.11 v41.15,15.11
N$15
  Top 0.406: IC6.6 C30.+ | R39.2 10.38,56.92
  Top 0.61: 10.38,56.92 C30.+
N$17
  Top 0.406: X6.1 R40.1
N$18
  Top 0.406: R40.2 IC4.4
N$20
  Top 0.406: X6.2 R33.1
N$23
  Top 0.406: IC5.3 R28.1 70.4,26.62 LED6.A
N$25
  Top 0.406: R34.1 X8.1
N$29
  Top 0.406: R37.1 X12.2
N$30
  Top 0.406: R38.1 X12.3
N$38
  Top 0.406: IC11.4 R34.2
N$39
  Top 0.406: R35.1 X8.2
N$40
  Top 0.406: R36.1 X10.1
N$41
  Top 0.406: IC13.4 R36.2
N$42
  Top 0.406: X10.2 R41.1
N$43
  Top 0.305: R42.1 X11.1
N$44
  Top 0.305: X11.2 R43.1
N$45
  Top 0.406: R44.1 LED7.A
N$46
  Top 0.406: IC14.16 R44.2
N$47
  Top 0.406: IC12.23 31.51,25.27 C24.A
N$48
  Top 0.406: R45.1 LED8.A
N$49
  Top 0.406: IC14.5 R45.2
OSC
  Top 0.406: R12.1 C1.1 IC5.16
PGC(ICSPCLK)  (via drill 0.5)
  Top 0.406: IC12.16 31.6,32.79 v31.62,32.83
  Bottom 0.406: v31.62,32.83 31.62,18.1 J1.5
PGD(ICSPDAT)  (via drill 0.5)
  Top 0.305: v32.96,32.07 32.58,32.07 32.51,32 IC12.17
  Bottom 0.406: v32.96,32.07 32.96,17.02 31.75,16.19 J1.4
QA
  Top 0.406: X7.3 61.85,63.75 58.67,60.58 58.67,52.91 IC14.9
QB
  Top 0.406: X7.1 66.93,64.58 66.29,63.94 63.75,63.94 60.26,60.45 IC14.8
RIGHT
  Top 0.406: IC12.10 32.3,38.38 32.19,38.48 32.19,58.93 33.78,60.52 34.98,60.52 R35.2
RX  (via drill 0.5)
  Top 0.406: IC3.1 38.37,7.76 v38.23,7.62 | v38.23,35.37 38.35,35.37 39.5,36.51 39.5,37.6 IC12.1
  Bottom 0.406: v38.23,7.62 v38.23,35.37
SEN_1
  Top 0.406: R25.1 87.67,10.51 R14.1
  Top 1.016: R14.1 89.47,10.6 90.36,11.49 90.36,13.59 IC10.1
SEN_2
  Top 0.406: R26.1 87.54,34.26 R15.1
  Top 1.016: R15.1 89.47,34.23 90.36,33.34 90.36,31.5 IC10.15
SENSE1  (via drill 0.6)
  Top 0.406: C3.1 R25.2 89.34,7.98 89.34,6.79 v88.2,5.65 | IC5.14 61.28,32.83 63.56,30.54 63.56,25.02 73.09,15.49 73.09,12.19 v79.63,5.65
  Bottom 0.406: v79.63,5.65 v88.2,5.65
SENSE2  (via drill 0.6)
  Top 0.406: C12.1 R26.2 89.24,38.04 88.8,38.48 v67.56,38.48 | IC5.13 64.71,34.1 v65.47,34.86
  Bottom 0.406: v65.47,34.86 65.47,36.39 v67.56,38.48
SQW/!INT  (via drill 0.5)
  Top 0.406: IC6.3 R30.2 21.21,56.92 21.21,57.66 v22.04,58.48 | IC12.15 28.78,33.6 v28.19,33.02 | v24,33.02 24,52.96 25.46,54.42 25.46,57.98 v24.96,58.48
  Bottom 0.406: v28.19,33.02 v24,33.02 | v24.96,58.48 v22.04,58.48
STEP  (via drill 0.5)
  Top 0.406: IC5.18 v61.34,27.75 | v61.34,19.24 33.08,19.24 33.08,26.36 IC12.25
  Bottom 0.406: v61.34,27.75 v61.34,19.24 61.34,19.37
TRIG  (via drill 0.5)
  Top 0.406: IC12.24 32.3,22.96 31.94,22.61 v24.45,22.61 | v24.45,30.29 21.02,33.66 21.02,36.32 21.03,36.32 R7.2
  Bottom 0.406: v24.45,22.61 v24.45,30.29
TX  (via drill 0.5)
  Top 0.305: IC3.4 43.5,6.29 v39.31,6.29 | v39.31,34.67 39.31,35.05 40.26,36.01 41.1,36.01
  Top 0.406: IC12.44 41.1,36.01
  Bottom 0.305: v39.31,6.29 v39.31,34.67
UP/MENU
  Top 0.406: IC12.8 33.9,38.68 33.53,39.05 33.53,48.01 36.58,51.05 42.55,51.05 48.7,57.21 48.7,59.56 49.66,60.52 50.81,60.52 R43.2
VBUS
  Top 0.406: X1.1 49.16,15.24 R10.2
VPP/!MCLR  (via drill 0.5)
  Top 0.305: IC12.18 34.2,31.22
  Top 0.406: v34.23,12.64 24.83,12.64 24.83,17.21 J1.1 | 34.2,31.22 v34.23,31.24
  Bottom 0.406: v34.23,31.24 v34.23,12.64
VREF
  Top 0.406: R18.1 50.74,30.67 R19.2 | C8.1 R19.2 | IC5.15 53,31.56 R19.2

### Text on the board
tNames: GND | 12V | vbus | D- | D+ | gnd
tValues: LCD | LEFT | RIGHT | DOWN | UP | AMT102 Rotary Encoder | CCM_0001 / Bipolar Stepper Motor Controller / Rev A / Oct 2014 | Trigger | Direction (CW/!CCW!) | USB